# EAGLE design relaisarray (EAGLE 7.2.0)

## Sheet 1 of 5
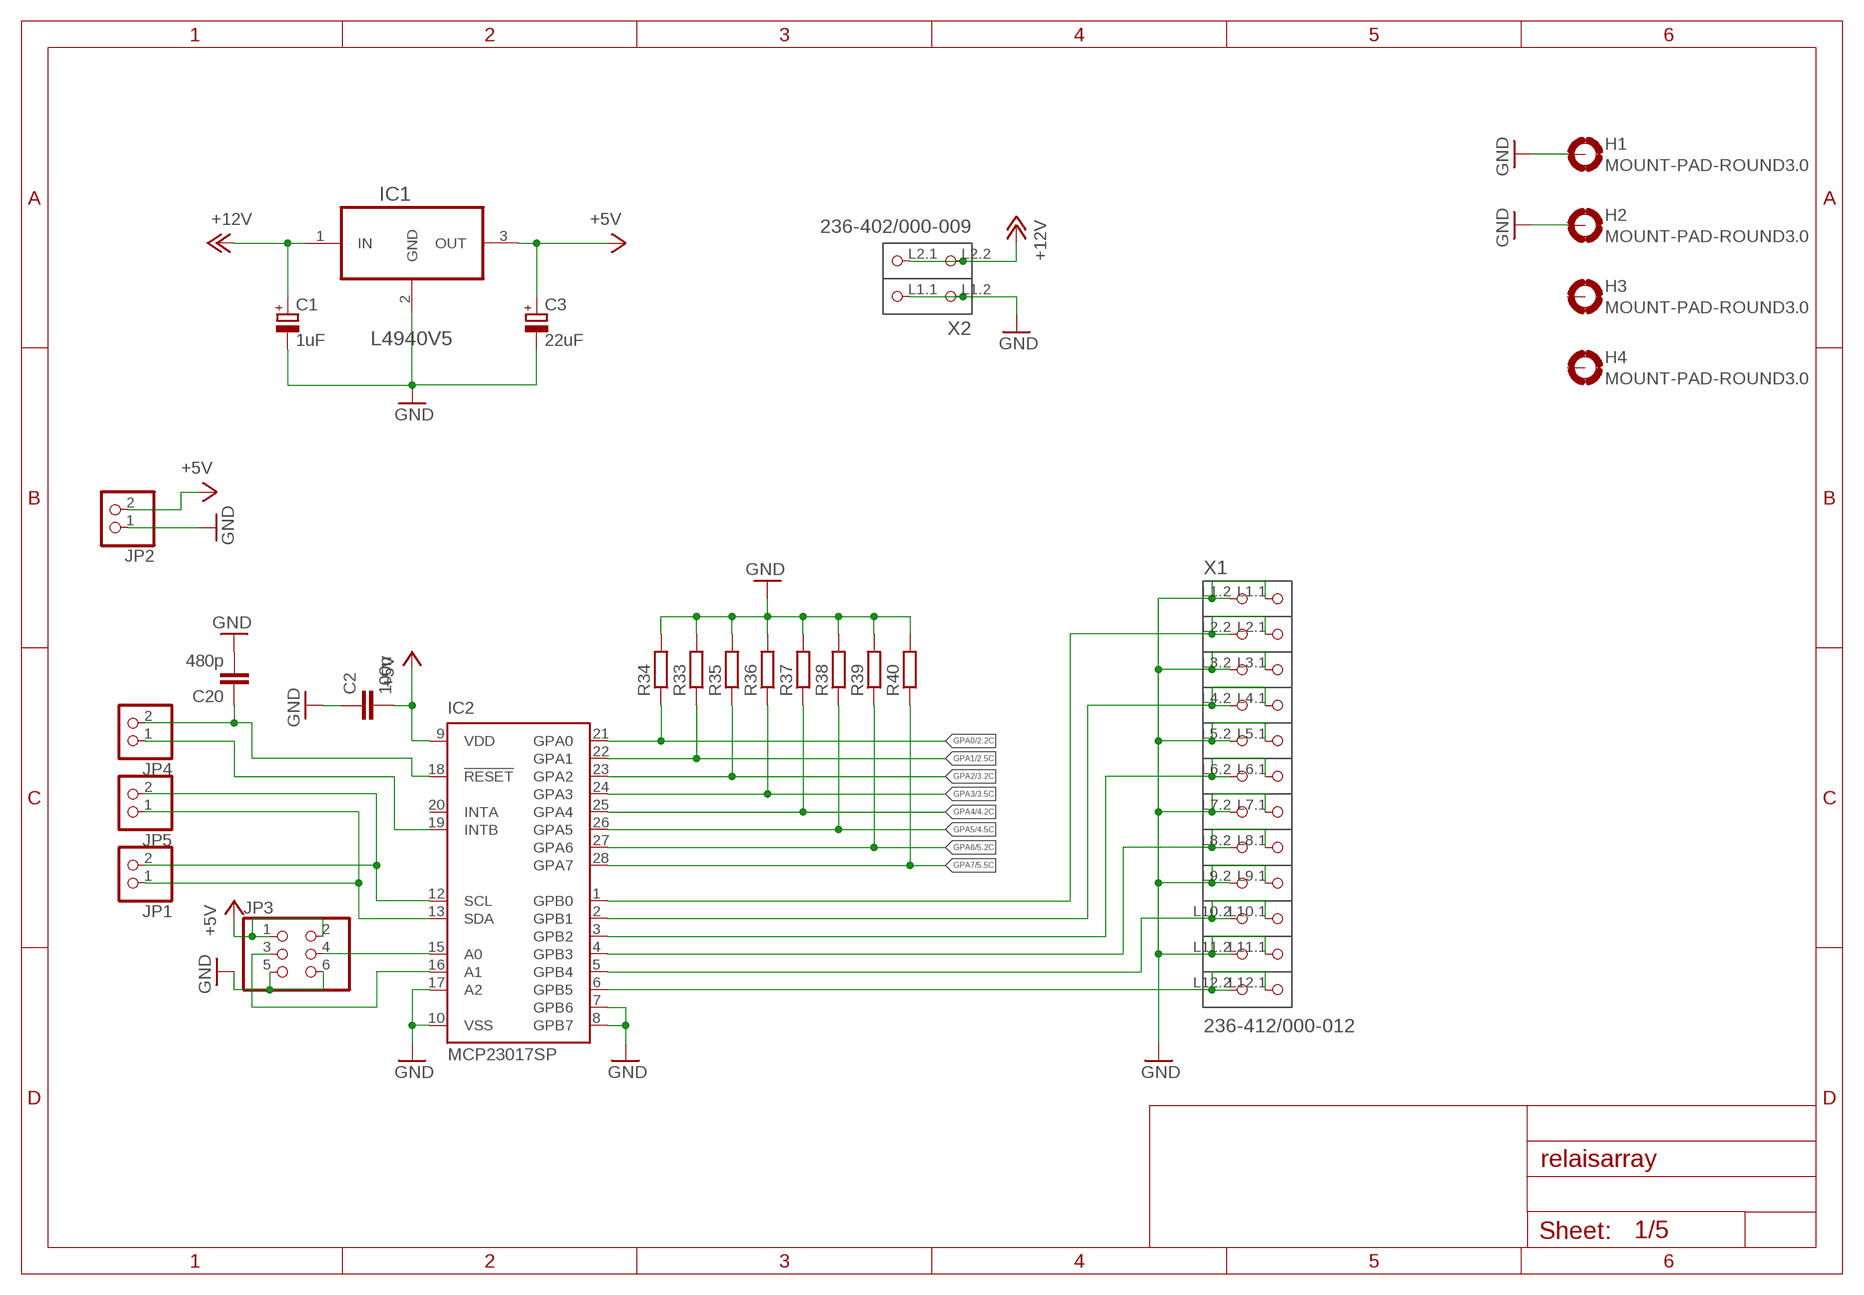
[diagram p0: schematic, sheet 1]

### Parts
C1  1uF  CPOL-EUTT2D5  [TT2D5]
C2  100n  C-EU050-035X075  [C050-035X075]
C3  22uF  CPOL-EUTT2D5  [TT2D5]
C20  480p  C-EU050-035X075  [C050-035X075]
H1  MOUNT-PAD-ROUND3.0  [3,0-PAD]
H2  MOUNT-PAD-ROUND3.0  [3,0-PAD]
H3  MOUNT-PAD-ROUND3.0  [3,0-PAD]
H4  MOUNT-PAD-ROUND3.0  [3,0-PAD]
IC1  L4940V5  [TO254P482X1024X3124-3P]
IC2  MCP23017SP  [DIL28-3]
JP1  PINHD-1X2  [1X02]
JP2  PINHD-1X2  [1X02]
JP3  PINHD-2X3  [2X03]
JP4  PINHD-1X2  [1X02]
JP5  PINHD-1X2  [1X02]
R33  R-EU_0207/10  [0207/10]
R34  R-EU_0207/10  [0207/10]
R35  R-EU_0207/10  [0207/10]
R36  R-EU_0207/10  [0207/10]
R37  R-EU_0207/10  [0207/10]
R38  R-EU_0207/10  [0207/10]
R39  R-EU_0207/10  [0207/10]
R40  R-EU_0207/10  [0207/10]
X1  236-412/000-012  [P-236-412]
X2  236-402/000-009  [P-236-402]

### Nets
+5V: C2.2 C3.+ IC1.3(OUT) IC2.9(VDD) JP2.2 JP3.1 JP3.2 ; also sheet 2,3,4,5
+12V: C1.+ IC1.1(IN) X2.L2.1(P2.1) X2.L2.2(P2.2) ; also sheet 2,3,4,5
GND: C1.- C2.1 C3.- C20.2 H1.B3,0(MOUNT) H2.B3,0(MOUNT) IC1.2(GND) IC2.7(GPB6) IC2.8(GPB7) IC2.10(VSS) IC2.17(A2) JP2.1 JP3.5 JP3.6 R33.2 R34.2 R35.2 R36.2 R37.2 R38.2 R39.2 R40.2 X1.L1.1(P1.1) X1.L1.2(P1.2) X1.L3.1(P3.1) X1.L3.2(P3.2) X1.L5.1(P5.1) X1.L5.2(P5.2) X1.L7.1(P7.1) X1.L7.2(P7.2) X1.L9.1(P9.1) X1.L9.2(P9.2) X1.L11.1(P11.1) X1.L11.2(P11.2) X2.L1.1(P1.1) X2.L1.2(P1.2) ; also sheet 2,3,4,5
GPA0: IC2.21(GPA0) R34.1 ; also sheet 2
GPA1: IC2.22(GPA1) R33.1 ; also sheet 2
GPA2: IC2.23(GPA2) R35.1 ; also sheet 3
GPA3: IC2.24(GPA3) R36.1 ; also sheet 3
GPA4: IC2.25(GPA4) R37.1 ; also sheet 4
GPA5: IC2.26(GPA5) R38.1 ; also sheet 4
GPA6: IC2.27(GPA6) R39.1 ; also sheet 5
GPA7: IC2.28(GPA7) R40.1 ; also sheet 5
INTB: IC2.19(INTB) JP4.1
N$8: IC2.16(A1) JP3.3
N$12: IC2.15(A0) JP3.4
N$14: IC2.6(GPB5) X1.L12.1(P12.1) X1.L12.2(P12.2)
N$15: IC2.5(GPB4) X1.L10.1(P10.1) X1.L10.2(P10.2)
N$16: IC2.4(GPB3) X1.L8.1(P8.1) X1.L8.2(P8.2)
N$17: IC2.3(GPB2) X1.L6.1(P6.1) X1.L6.2(P6.2)
N$18: IC2.2(GPB1) X1.L4.1(P4.1) X1.L4.2(P4.2)
N$19: IC2.1(GPB0) X1.L2.1(P2.1) X1.L2.2(P2.2)
RESET: C20.1 IC2.18(!RESET) JP4.2
SCL: IC2.12(SCL) JP1.2 JP5.2
SDA: IC2.13(SDA) JP1.1 JP5.1
Unconnected: H3.B3,0(MOUNT) H4.B3,0(MOUNT) IC2.20(INTA)

## Sheet 2 of 5
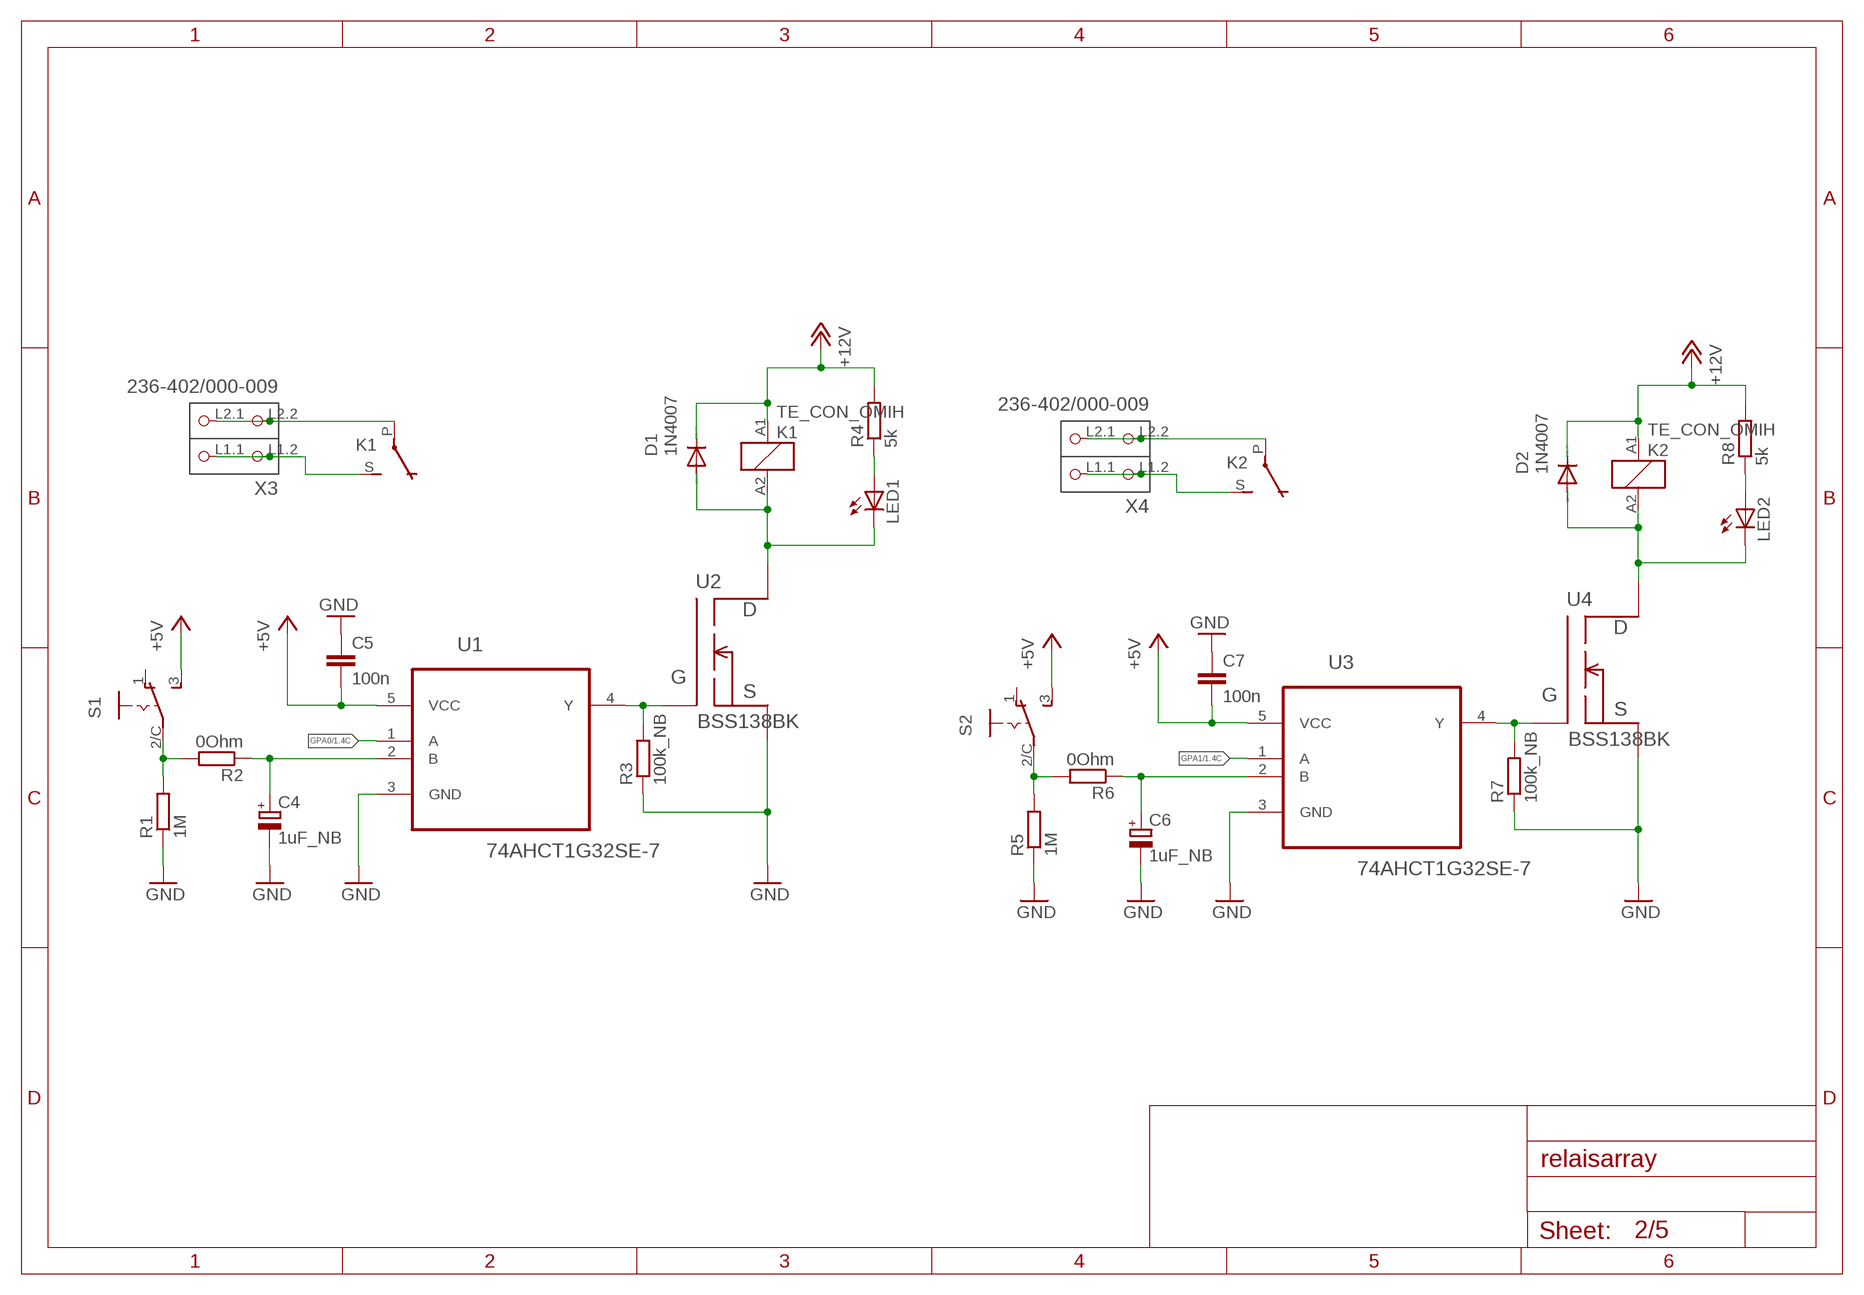
[diagram p1: schematic, sheet 2]

### Parts
C4  1uF_NB  CPOL-EUTT2D5  [TT2D5]
C5  100n  C-EU050-035X075  [C050-035X075]
C6  1uF_NB  CPOL-EUTT2D5  [TT2D5]
C7  100n  C-EU050-035X075  [C050-035X075]
D1  1N4007  1N4004  [DO41-10]
D2  1N4007  1N4004  [DO41-10]
K1  TE_CON_OMIH  [TE_CON_OMIH]
K2  TE_CON_OMIH  [TE_CON_OMIH]
LED1  LED5MM  [LED5MM]
LED2  LED5MM  [LED5MM]
R1  1M  R-EU_0207/10  [0207/10]
R2  0Ohm  R-EU_0207/10  [0207/10]
R3  100k_NB  R-EU_0207/10  [0207/10]
R4  5k  R-EU_0207/10  [0207/10]
R5  1M  R-EU_0207/10  [0207/10]
R6  0Ohm  R-EU_0207/10  [0207/10]
R7  100k_NB  R-EU_0207/10  [0207/10]
R8  5k  R-EU_0207/10  [0207/10]
S1  OS102011MS2QS1  [OS102011MS2QS1]
S2  OS102011MS2QS1  [OS102011MS2QS1]
U1  74AHCT1G32SE-7  [SOT65P210X110-5N]
U2  BSS138BK  [SOT65P210X110-3N]
U3  74AHCT1G32SE-7  [SOT65P210X110-5N]
U4  BSS138BK  [SOT65P210X110-3N]
X3  236-402/000-009  [P-236-402]
X4  236-402/000-009  [P-236-402]

### Nets
+5V: C5.2 C7.2 S1.3 S2.3 U1.5(VCC) U3.5(VCC) ; also sheet 1,3,4,5
+12V: D1.C D2.C K1.A1(1:A1) K2.A1(1:A1) R4.2 R8.2 ; also sheet 1,3,4,5
GND: C4.- C5.1 C6.- C7.1 R1.1 R3.1 R5.1 R7.1 U1.3(GND) U2.2(S) U3.3(GND) U4.2(S) ; also sheet 1,3,4,5
GPA0: U1.1(A) ; also sheet 1
GPA1: U3.1(A) ; also sheet 1
N$55: R3.2 U1.4(Y) U2.1(G)
N$56: LED1.A R4.1
N$57: D1.A K1.A2(1:A2) LED1.K(C) U2.3(D)
N$58: R1.2 R2.2 S1.2/C
N$59: K1.P(2:P) X3.L2.1(P2.1) X3.L2.2(P2.2)
N$60: K1.S(2:S) X3.L1.1(P1.1) X3.L1.2(P1.2)
N$61: C4.+ R2.1 U1.2(B)
N$62: R7.2 U3.4(Y) U4.1(G)
N$63: LED2.A R8.1
N$64: D2.A K2.A2(1:A2) LED2.K(C) U4.3(D)
N$65: R5.2 R6.2 S2.2/C
N$66: K2.P(2:P) X4.L2.1(P2.1) X4.L2.2(P2.2)
N$67: K2.S(2:S) X4.L1.1(P1.1) X4.L1.2(P1.2)
N$68: C6.+ R6.1 U3.2(B)
Unconnected: S1.1 S2.1

## Sheet 3 of 5
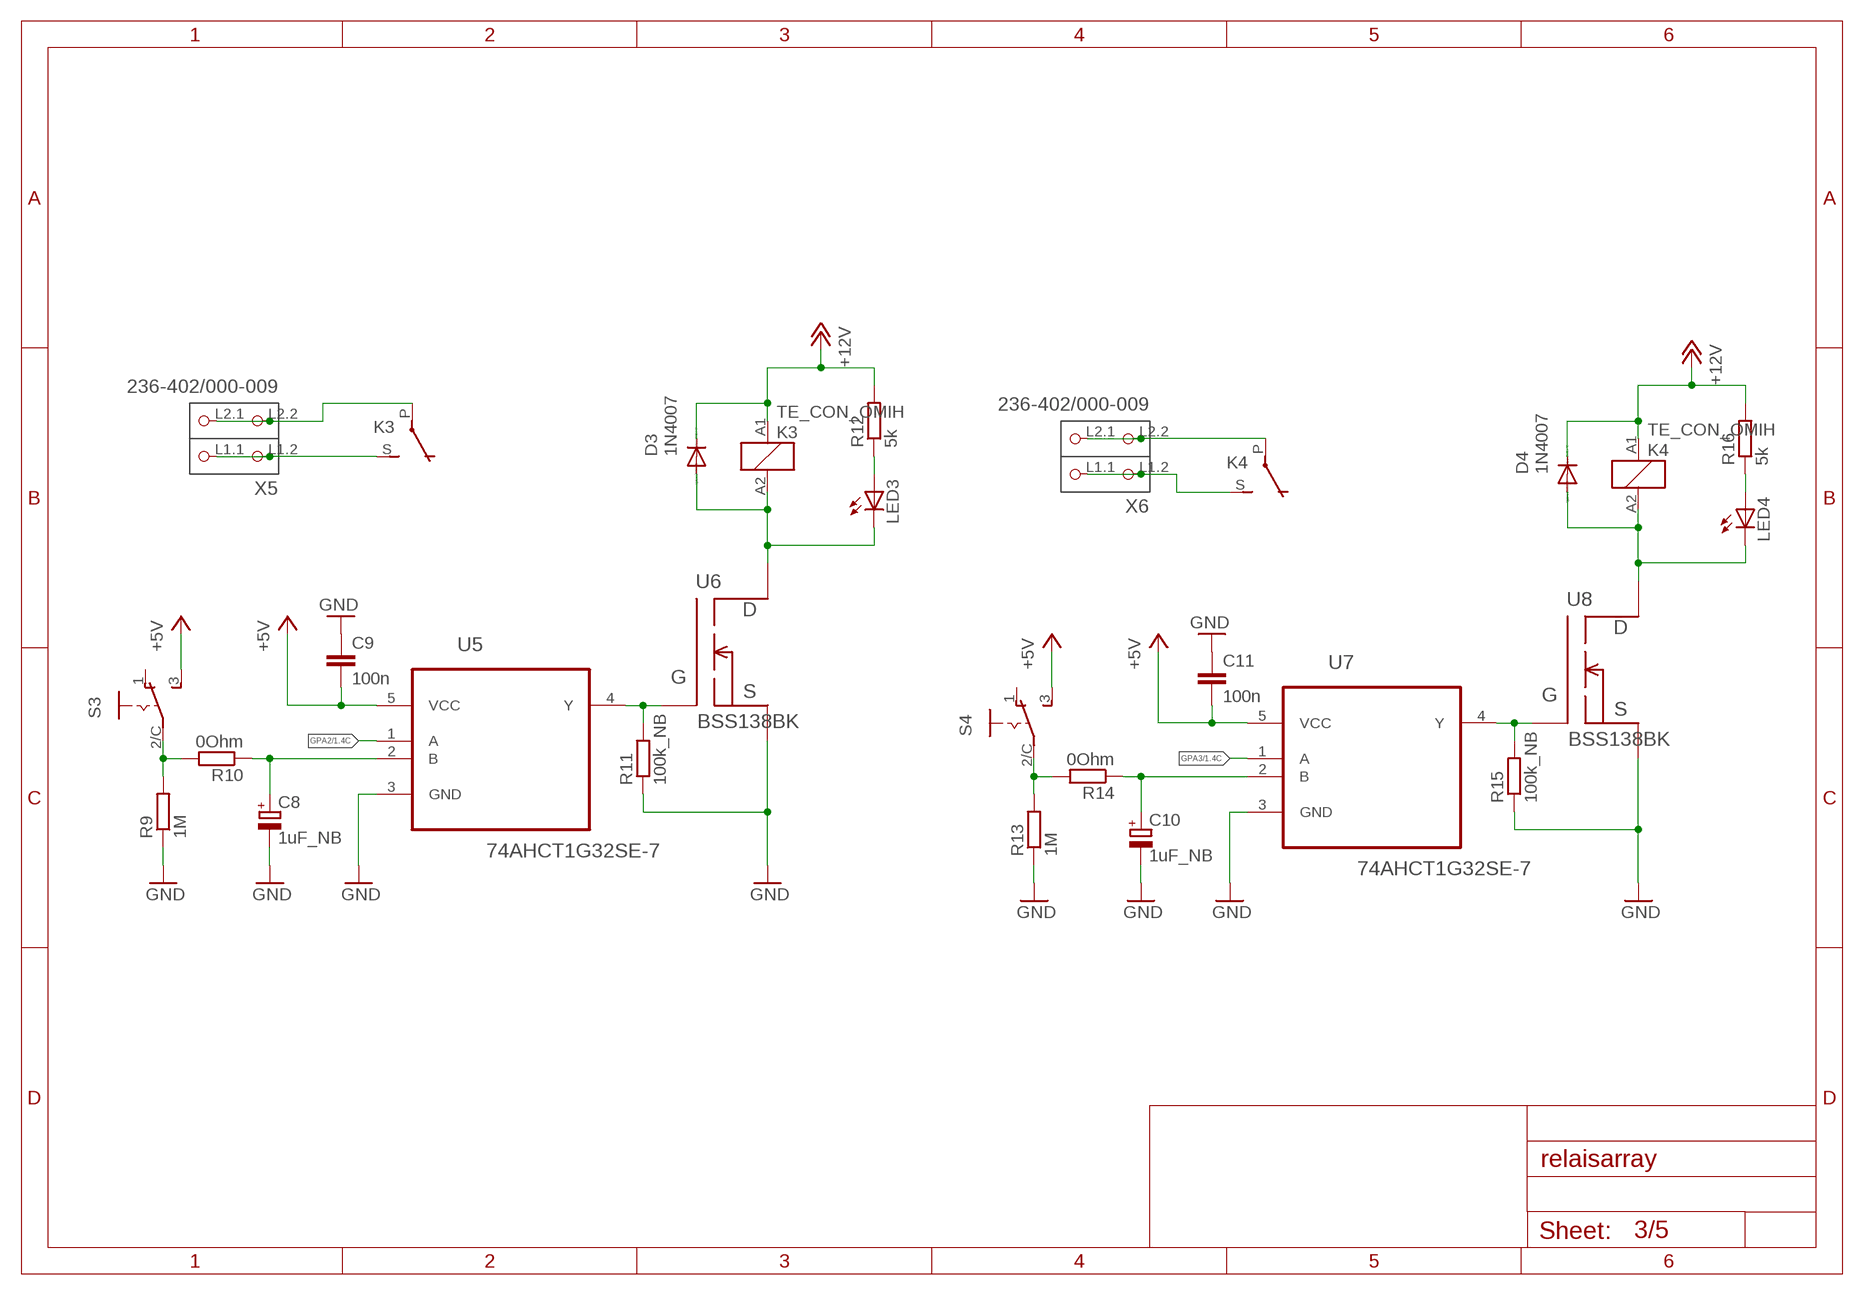
[diagram p2: schematic, sheet 3]

### Parts
C8  1uF_NB  CPOL-EUTT2D5  [TT2D5]
C9  100n  C-EU050-035X075  [C050-035X075]
C10  1uF_NB  CPOL-EUTT2D5  [TT2D5]
C11  100n  C-EU050-035X075  [C050-035X075]
D3  1N4007  1N4004  [DO41-10]
D4  1N4007  1N4004  [DO41-10]
K3  TE_CON_OMIH  [TE_CON_OMIH]
K4  TE_CON_OMIH  [TE_CON_OMIH]
LED3  LED5MM  [LED5MM]
LED4  LED5MM  [LED5MM]
R9  1M  R-EU_0207/10  [0207/10]
R10  0Ohm  R-EU_0207/10  [0207/10]
R11  100k_NB  R-EU_0207/10  [0207/10]
R12  5k  R-EU_0207/10  [0207/10]
R13  1M  R-EU_0207/10  [0207/10]
R14  0Ohm  R-EU_0207/10  [0207/10]
R15  100k_NB  R-EU_0207/10  [0207/10]
R16  5k  R-EU_0207/10  [0207/10]
S3  OS102011MS2QS1  [OS102011MS2QS1]
S4  OS102011MS2QS1  [OS102011MS2QS1]
U5  74AHCT1G32SE-7  [SOT65P210X110-5N]
U6  BSS138BK  [SOT65P210X110-3N]
U7  74AHCT1G32SE-7  [SOT65P210X110-5N]
U8  BSS138BK  [SOT65P210X110-3N]
X5  236-402/000-009  [P-236-402]
X6  236-402/000-009  [P-236-402]

### Nets
+5V: C9.2 C11.2 S3.3 S4.3 U5.5(VCC) U7.5(VCC) ; also sheet 1,2,4,5
+12V: D3.C D4.C K3.A1(1:A1) K4.A1(1:A1) R12.2 R16.2 ; also sheet 1,2,4,5
GND: C8.- C9.1 C10.- C11.1 R9.1 R11.1 R13.1 R15.1 U5.3(GND) U6.2(S) U7.3(GND) U8.2(S) ; also sheet 1,2,4,5
GPA2: U5.1(A) ; also sheet 1
GPA3: U7.1(A) ; also sheet 1
N$1: R11.2 U5.4(Y) U6.1(G)
N$2: LED3.A R12.1
N$3: D3.A K3.A2(1:A2) LED3.K(C) U6.3(D)
N$4: R9.2 R10.2 S3.2/C
N$5: K3.P(2:P) X5.L2.1(P2.1) X5.L2.2(P2.2)
N$6: K3.S(2:S) X5.L1.1(P1.1) X5.L1.2(P1.2)
N$7: C8.+ R10.1 U5.2(B)
N$20: R15.2 U7.4(Y) U8.1(G)
N$21: LED4.A R16.1
N$22: D4.A K4.A2(1:A2) LED4.K(C) U8.3(D)
N$23: R13.2 R14.2 S4.2/C
N$24: K4.P(2:P) X6.L2.1(P2.1) X6.L2.2(P2.2)
N$25: K4.S(2:S) X6.L1.1(P1.1) X6.L1.2(P1.2)
N$26: C10.+ R14.1 U7.2(B)
Unconnected: S3.1 S4.1

## Sheet 4 of 5
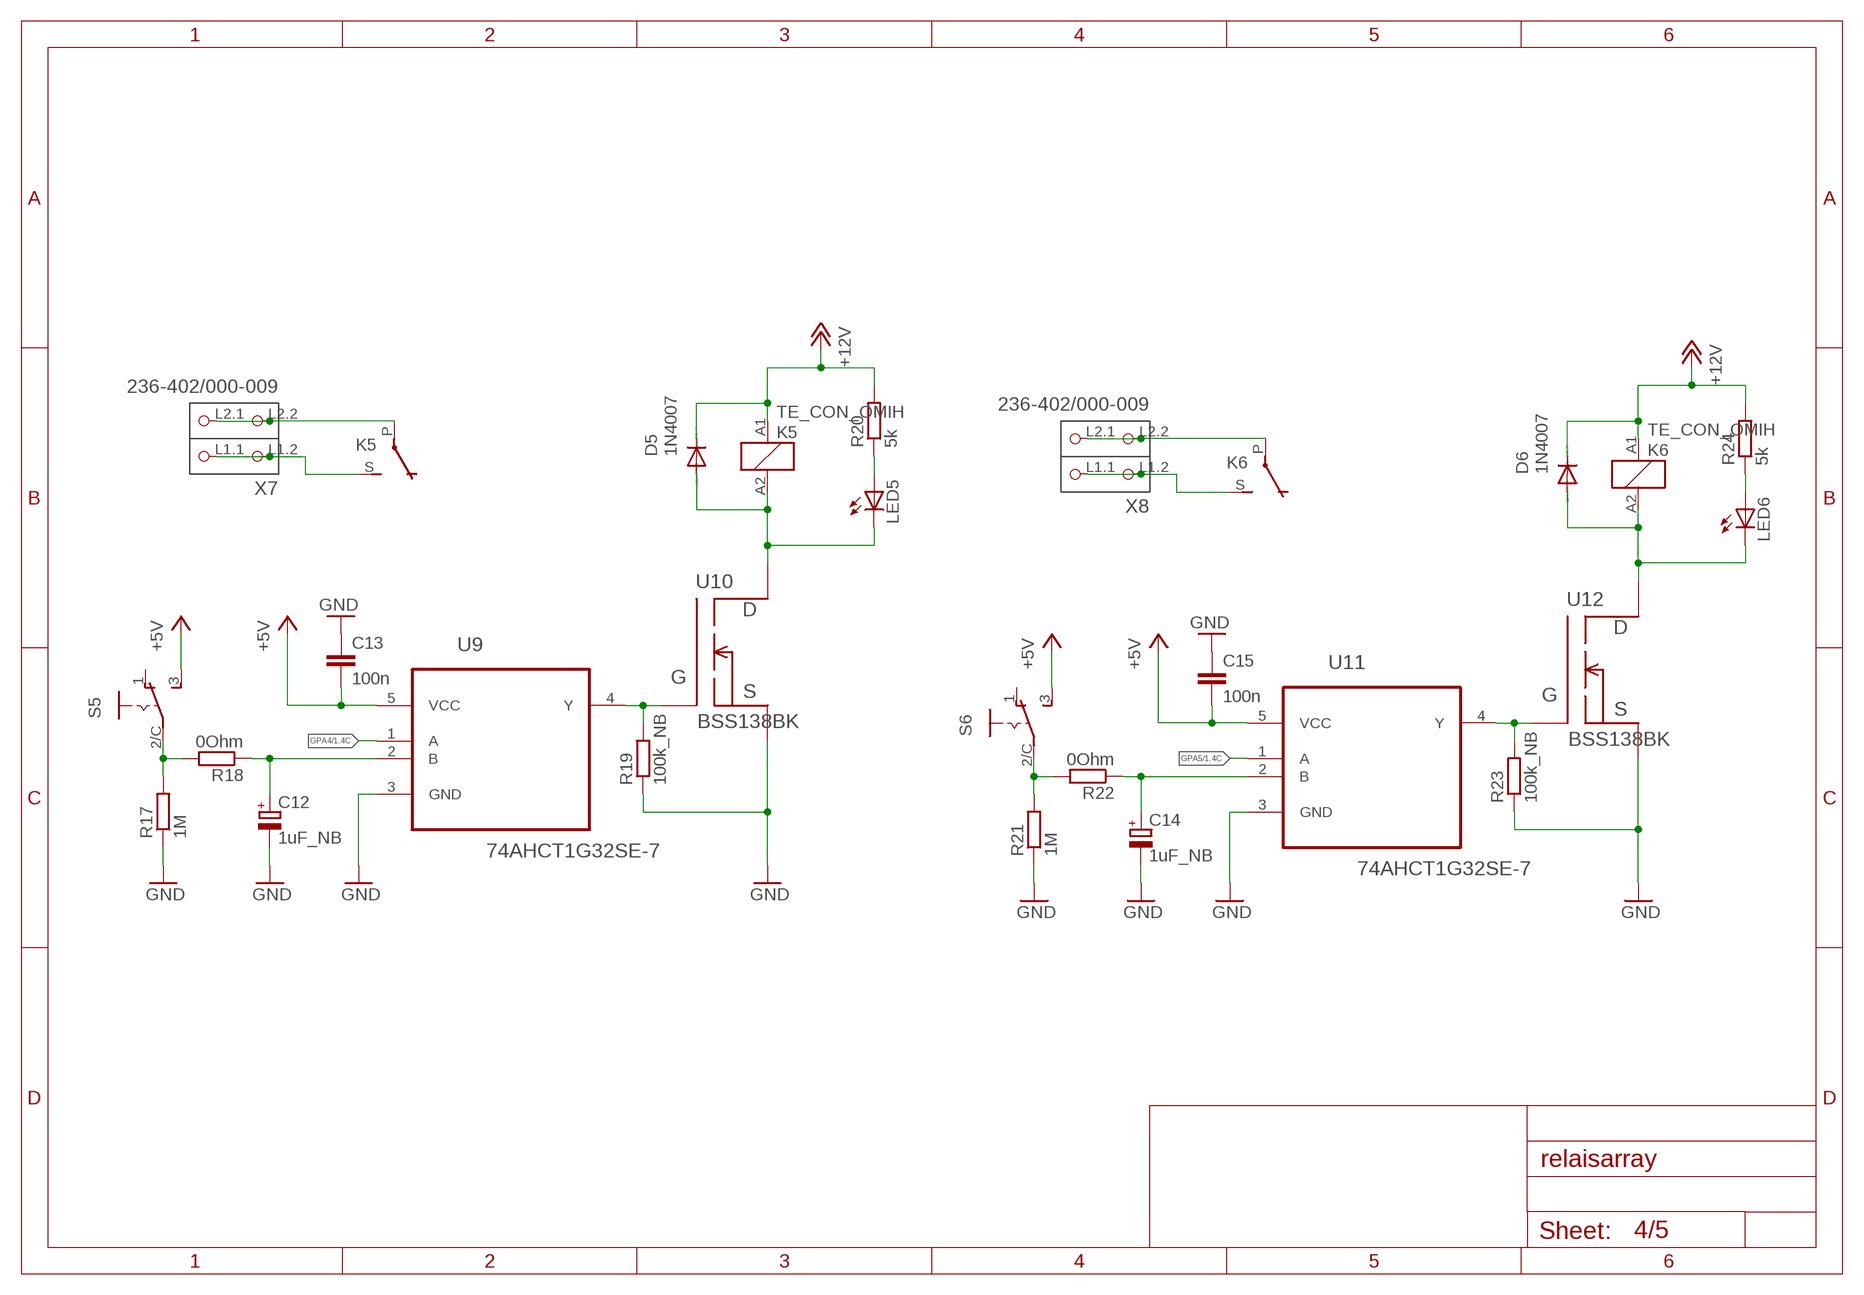
[diagram p3: schematic, sheet 4]

### Parts
C12  1uF_NB  CPOL-EUTT2D5  [TT2D5]
C13  100n  C-EU050-035X075  [C050-035X075]
C14  1uF_NB  CPOL-EUTT2D5  [TT2D5]
C15  100n  C-EU050-035X075  [C050-035X075]
D5  1N4007  1N4004  [DO41-10]
D6  1N4007  1N4004  [DO41-10]
K5  TE_CON_OMIH  [TE_CON_OMIH]
K6  TE_CON_OMIH  [TE_CON_OMIH]
LED5  LED5MM  [LED5MM]
LED6  LED5MM  [LED5MM]
R17  1M  R-EU_0207/10  [0207/10]
R18  0Ohm  R-EU_0207/10  [0207/10]
R19  100k_NB  R-EU_0207/10  [0207/10]
R20  5k  R-EU_0207/10  [0207/10]
R21  1M  R-EU_0207/10  [0207/10]
R22  0Ohm  R-EU_0207/10  [0207/10]
R23  100k_NB  R-EU_0207/10  [0207/10]
R24  5k  R-EU_0207/10  [0207/10]
S5  OS102011MS2QS1  [OS102011MS2QS1]
S6  OS102011MS2QS1  [OS102011MS2QS1]
U9  74AHCT1G32SE-7  [SOT65P210X110-5N]
U10  BSS138BK  [SOT65P210X110-3N]
U11  74AHCT1G32SE-7  [SOT65P210X110-5N]
U12  BSS138BK  [SOT65P210X110-3N]
X7  236-402/000-009  [P-236-402]
X8  236-402/000-009  [P-236-402]

### Nets
+5V: C13.2 C15.2 S5.3 S6.3 U9.5(VCC) U11.5(VCC) ; also sheet 1,2,3,5
+12V: D5.C D6.C K5.A1(1:A1) K6.A1(1:A1) R20.2 R24.2 ; also sheet 1,2,3,5
GND: C12.- C13.1 C14.- C15.1 R17.1 R19.1 R21.1 R23.1 U9.3(GND) U10.2(S) U11.3(GND) U12.2(S) ; also sheet 1,2,3,5
GPA4: U9.1(A) ; also sheet 1
GPA5: U11.1(A) ; also sheet 1
N$27: R19.2 U9.4(Y) U10.1(G)
N$28: LED5.A R20.1
N$29: D5.A K5.A2(1:A2) LED5.K(C) U10.3(D)
N$30: R17.2 R18.2 S5.2/C
N$31: K5.P(2:P) X7.L2.1(P2.1) X7.L2.2(P2.2)
N$32: K5.S(2:S) X7.L1.1(P1.1) X7.L1.2(P1.2)
N$33: C12.+ R18.1 U9.2(B)
N$34: R23.2 U11.4(Y) U12.1(G)
N$35: LED6.A R24.1
N$36: D6.A K6.A2(1:A2) LED6.K(C) U12.3(D)
N$37: R21.2 R22.2 S6.2/C
N$38: K6.P(2:P) X8.L2.1(P2.1) X8.L2.2(P2.2)
N$39: K6.S(2:S) X8.L1.1(P1.1) X8.L1.2(P1.2)
N$40: C14.+ R22.1 U11.2(B)
Unconnected: S5.1 S6.1

## Sheet 5 of 5
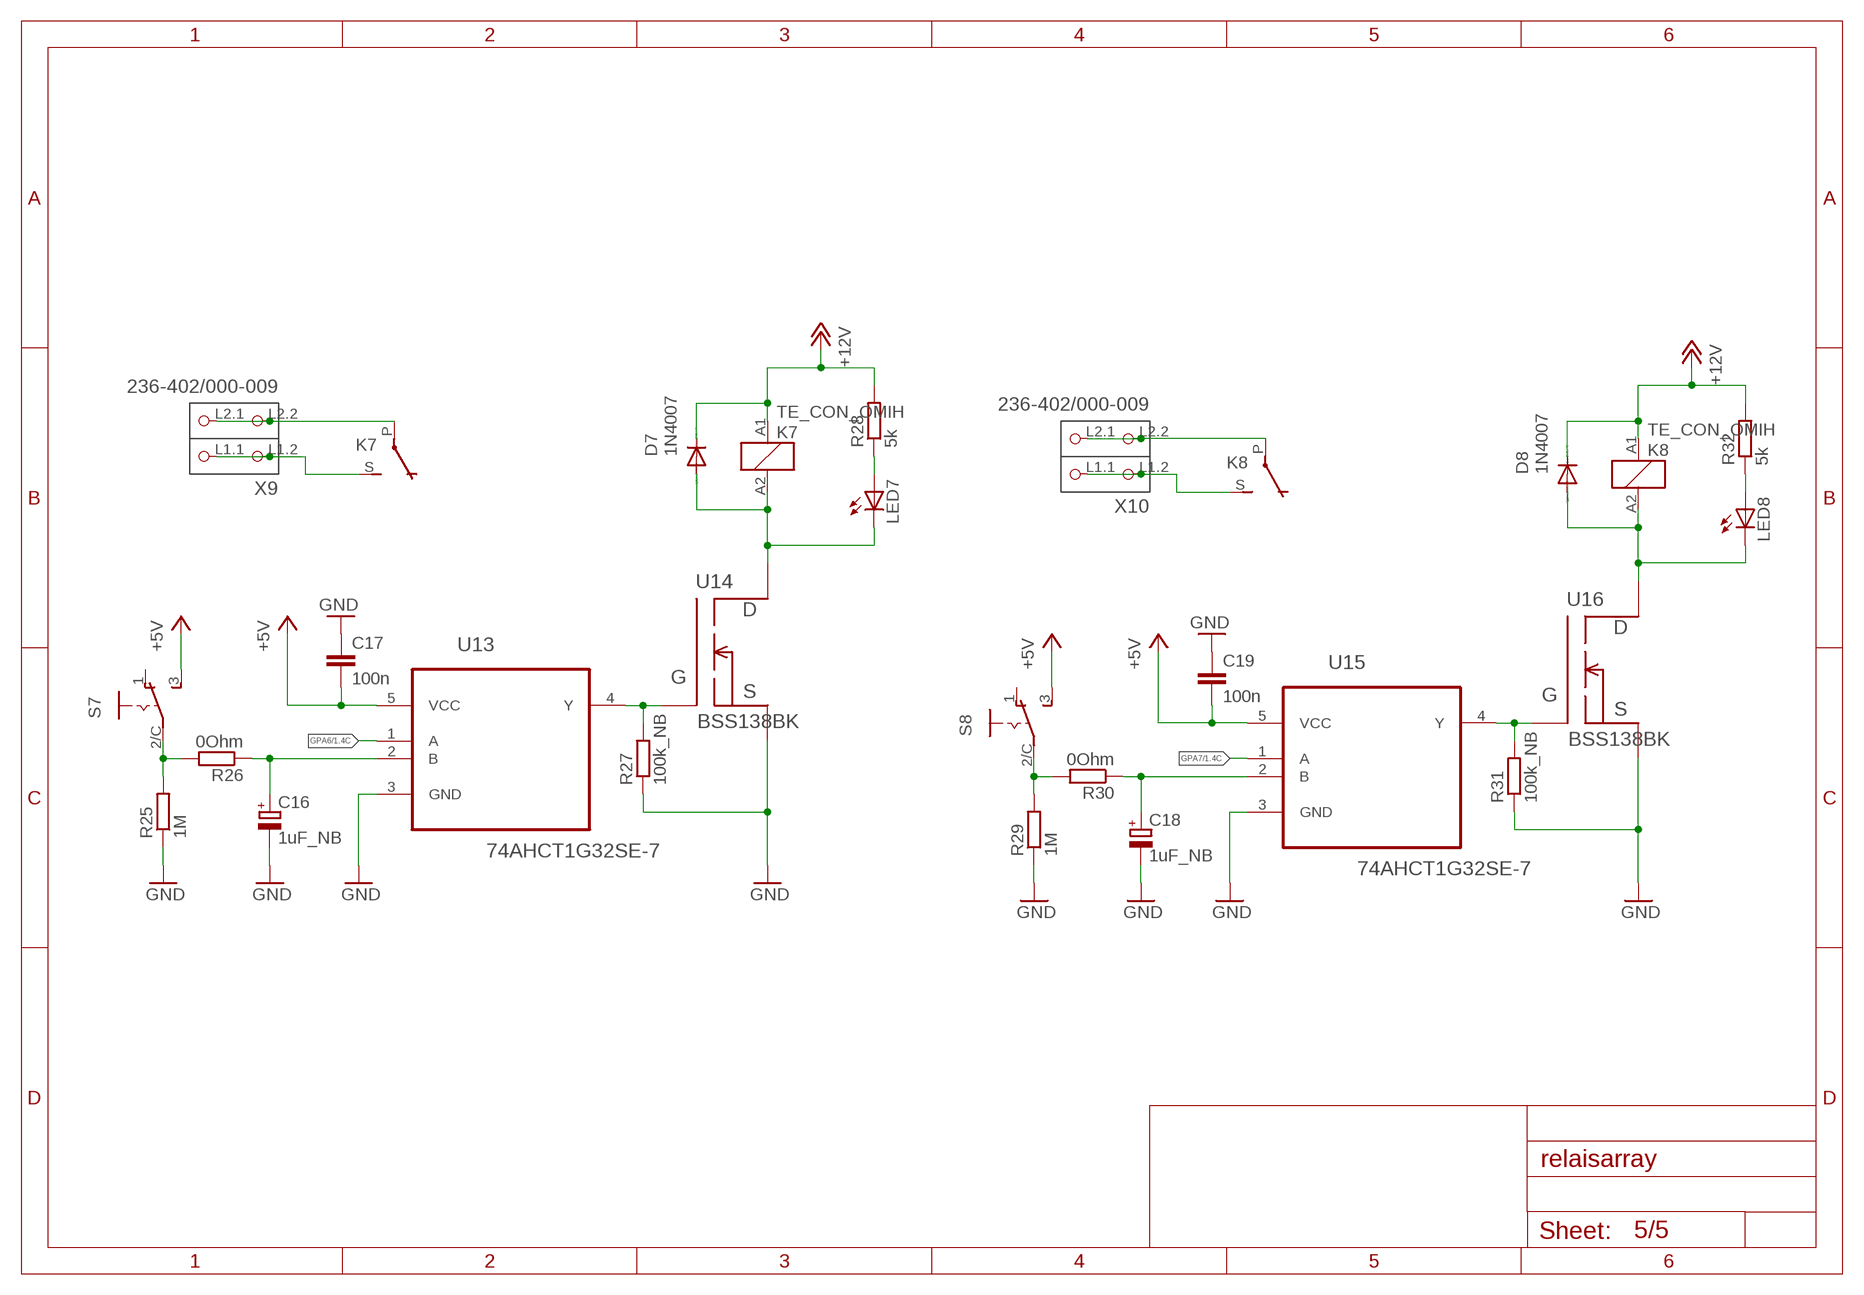
[diagram p4: schematic, sheet 5]

### Parts
C16  1uF_NB  CPOL-EUTT2D5  [TT2D5]
C17  100n  C-EU050-035X075  [C050-035X075]
C18  1uF_NB  CPOL-EUTT2D5  [TT2D5]
C19  100n  C-EU050-035X075  [C050-035X075]
D7  1N4007  1N4004  [DO41-10]
D8  1N4007  1N4004  [DO41-10]
K7  TE_CON_OMIH  [TE_CON_OMIH]
K8  TE_CON_OMIH  [TE_CON_OMIH]
LED7  LED5MM  [LED5MM]
LED8  LED5MM  [LED5MM]
R25  1M  R-EU_0207/10  [0207/10]
R26  0Ohm  R-EU_0207/10  [0207/10]
R27  100k_NB  R-EU_0207/10  [0207/10]
R28  5k  R-EU_0207/10  [0207/10]
R29  1M  R-EU_0207/10  [0207/10]
R30  0Ohm  R-EU_0207/10  [0207/10]
R31  100k_NB  R-EU_0207/10  [0207/10]
R32  5k  R-EU_0207/10  [0207/10]
S7  OS102011MS2QS1  [OS102011MS2QS1]
S8  OS102011MS2QS1  [OS102011MS2QS1]
U13  74AHCT1G32SE-7  [SOT65P210X110-5N]
U14  BSS138BK  [SOT65P210X110-3N]
U15  74AHCT1G32SE-7  [SOT65P210X110-5N]
U16  BSS138BK  [SOT65P210X110-3N]
X9  236-402/000-009  [P-236-402]
X10  236-402/000-009  [P-236-402]

### Nets
+5V: C17.2 C19.2 S7.3 S8.3 U13.5(VCC) U15.5(VCC) ; also sheet 1,2,3,4
+12V: D7.C D8.C K7.A1(1:A1) K8.A1(1:A1) R28.2 R32.2 ; also sheet 1,2,3,4
GND: C16.- C17.1 C18.- C19.1 R25.1 R27.1 R29.1 R31.1 U13.3(GND) U14.2(S) U15.3(GND) U16.2(S) ; also sheet 1,2,3,4
GPA6: U13.1(A) ; also sheet 1
GPA7: U15.1(A) ; also sheet 1
N$41: R27.2 U13.4(Y) U14.1(G)
N$42: LED7.A R28.1
N$43: D7.A K7.A2(1:A2) LED7.K(C) U14.3(D)
N$44: R25.2 R26.2 S7.2/C
N$45: K7.P(2:P) X9.L2.1(P2.1) X9.L2.2(P2.2)
N$46: K7.S(2:S) X9.L1.1(P1.1) X9.L1.2(P1.2)
N$47: C16.+ R26.1 U13.2(B)
N$48: R31.2 U15.4(Y) U16.1(G)
N$49: LED8.A R32.1
N$50: D8.A K8.A2(1:A2) LED8.K(C) U16.3(D)
N$51: R29.2 R30.2 S8.2/C
N$52: K8.P(2:P) X10.L2.1(P2.1) X10.L2.2(P2.2)
N$53: K8.S(2:S) X10.L1.1(P1.1) X10.L1.2(P1.2)
N$54: C18.+ R30.1 U15.2(B)
Unconnected: S7.1 S8.1

## Library data of the parts
C1 C3 C4 C6 C8 C10 C12 C14 C16 C18 = rcl:CPOL-EU: POLARIZED CAPACITOR, European symbol
C2 C5 C7 C9 C11 C13 C15 C17 C19 C20 = rcl:C-EU: CAPACITOR, European symbol
D1-D8 = diode:1N4004: DIODE general purpose rectifier, 1 A
H1-H4 = holes:MOUNT-PAD-ROUND: MOUNTING PAD, round
IC1 = L4940V5:L4940V5: IC, V REG LDO +5.0V, 4940, TO-220-3; MPN: L4940V5; OC_FARNELL: 9756060; OC_NEWARK: 89K0746; PACKAGE: TO-220-3; SUPPLIER: STMicroelectronics
IC2 = microchip:MCP23017: http://ww1.microchip.com/downloads/en/DeviceDoc/21952a.pdf Source: http://ww1.microchip.com/downloads/en/DeviceDoc/21952a.pdf; MF: MICROCHIP; MPN: MCP23017-E/SP; OC_FARNELL: 1332088; OC_NEWARK: 31K2959
JP1 JP2 JP4 JP5 = pinhead:PINHD-1X2: PIN HEADER
JP3 = pinhead:PINHD-2X3: PIN HEADER
K1-K8 = TE_CON_OMIH:TE_CON_OMIH: Power PCB Relay OMIH TE Connectivity 250V/ 16 A - 12V Coil Farnell: 1891736
LED1-LED8 = led:LED: LED OSRAM: - CHIPLED LG R971, LG N971, LY N971, LG Q971, LY Q971, LO R971, LY R971 LH N974, LH R974 LS Q976, LO Q976, LY Q976 LO Q996 - Hyper CHIPLED LW Q18S LB Q993, LB Q99A, LB R99A - SideLED LS A670, LO A670, LY A670, LG A670, LP A670 LB A673, LV A673, LT A673, LW A673 LH A674 LY A675 LS A676, LA A676, LO A676, LY A676, LW A676 LS A679, LY A679, LG A679 - Hyper Micro SIDELED® LS Y876, LA Y876, LO Y876, LY Y876 LT Y87S - SmartLED LW L88C, LW L88S LB L89C, LB L89S, LG L890 LS L89K, LO L89K, LY L89K LS L896, LA L896, LO L896, LY L896 - TOPLED LS T670, LO T670, LY T670, LG T670, LP T670 LSG T670, LSP T670, LSY T670, LOP T670, LYG T670 LG T671, LOG T671, LSG T671 LB T673, LV T673, LT T673, LW T673 LH T674 LS T676, LA T676, LO T676, LY T676, LB T676, LH T676, LSB T676, LW T676 LB T67C, LV T67C, LT T67C, LS T67K, LO T67K, LY T67K, LW E67C LS E67B, LA E67B, LO E67B, LY E67B, LB E67C, LV E67C, LT E67C LW T67C LS T679, LY T679, LG T679 LS T770, LO T770, LY T770, LG T770, LP T770 LB T773, LV T773, LT T773, LW T773 LH T774 LS E675, LA E675, LY E675, LS T675 LS T776, LA T776, LO T776, LY T776, LB T776 LHGB T686 LT T68C, LB T68C - Hyper Mini TOPLED® LB M676 - Mini TOPLED Santana® LG M470 LS M47K, LO M47K, LY M47K Source: http://www.osram.convergy.de LUXEON: - LUMILED® LXK2-PW12-R00, LXK2-PW12-S00, LXK2-PW14-U00, LXK2-PW14-V00 LXK2-PM12-R00, LXK2-PM12-S00, LXK2-PM14-U00 LXK2-PE12-Q00, LXK2-PE12-R00, LXK2-PE12-S00, LXK2-PE14-T00, LXK2-PE14-U00 LXK2-PB12-K00, LXK2-PB12-L00, LXK2-PB12-M00, LXK2-PB14-N00, LXK2-PB14-P00, LXK2-PB14-Q00 LXK2-PR12-L00, LXK2-PR12-M00, LXK2-PR14-Q00, LXK2-PR14-R00 LXK2-PD12-Q00, LXK2-PD12-R00, LXK2-PD12-S00 LXK2-PH12-R00, LXK2-PH12-S00 LXK2-PL12-P00, LXK2-PL12-Q00, LXK2-PL12-R00 Source: www.luxeon.com KINGBRIGHT: KA-3528ASYC Source: www.kingbright.com
R1-R40 = rcl:R-EU_: RESISTOR, European symbol
S1-S8 = OS102011MS2QS1:OS102011MS2QS1: SLIDING SWITCH Distributor Farnell: 2435105
U1 U3 U5 U7 U9 U11 U13 U15 = 74AHCT1G32SE:74AHCT1G32SE-7: SINGLE 2 INPUT POSITIVE OR GATE; MPN: 74AHCT1G32SE-7; OC_FARNELL: 2057398; OC_NEWARK: 64T4877; PACKAGE: SOT-353-5; SUPPLIER: Diodes INC
U2 U4 U6 U8 U10 U12 U14 U16 = BSS138:BSS138BK: N-channel Trench MOSFET; MPN: BSS138BK; OC_FARNELL: 2053833; OC_NEWARK: 61T7486; PACKAGE: SOT-23-3; SUPPLIER: NXP
X1 = con-wago_236:236-412/000-012: Stand: 01.01.2014. Die jeweils aktuellen Daten zu diesem Artikel finden Sie in unserem Produktkatalog, den Sie unter www.wago.com einsehen können. As of: 01/01/2014. Please find the newest data for this article in our product catalogue, which can be viewed under www.wago.com.
X2-X10 = con-wago_236:236-402/000-009: Serie 236, / Series 236, Polzahl / Pole No.: 2 Rastermaß / Pitch: 5 - 5.08 mm Bemessungsspannung / Rated Voltage: 320 V Nennstrom / Nominal Current: 24 A Leiterquerschnitt / Conductor Size: 0.08 - 2.5 mm2 Anschlusstechnik / Connection Technology: CAGE CLAMP® Lötstiftlänge: / Solder Pin Length: 4 mm Leitereinführung (zur Platine) / Conductor entry angle (to PCB): 45 ° Farbe / Color: lichtgrau / lichtgrau Stand: 01.01.2014. Die jeweils aktuellen Daten zu diesem Artikel finden Sie in unserem Produktkatalog, den Sie unter www.wago.com einsehen können. As of: 01/01/2014. Please find the newest data for this article in our product catalogue, which can be viewed under www.wago.com.

## Net classes
0 default: clearance 0.205 mm

## Board
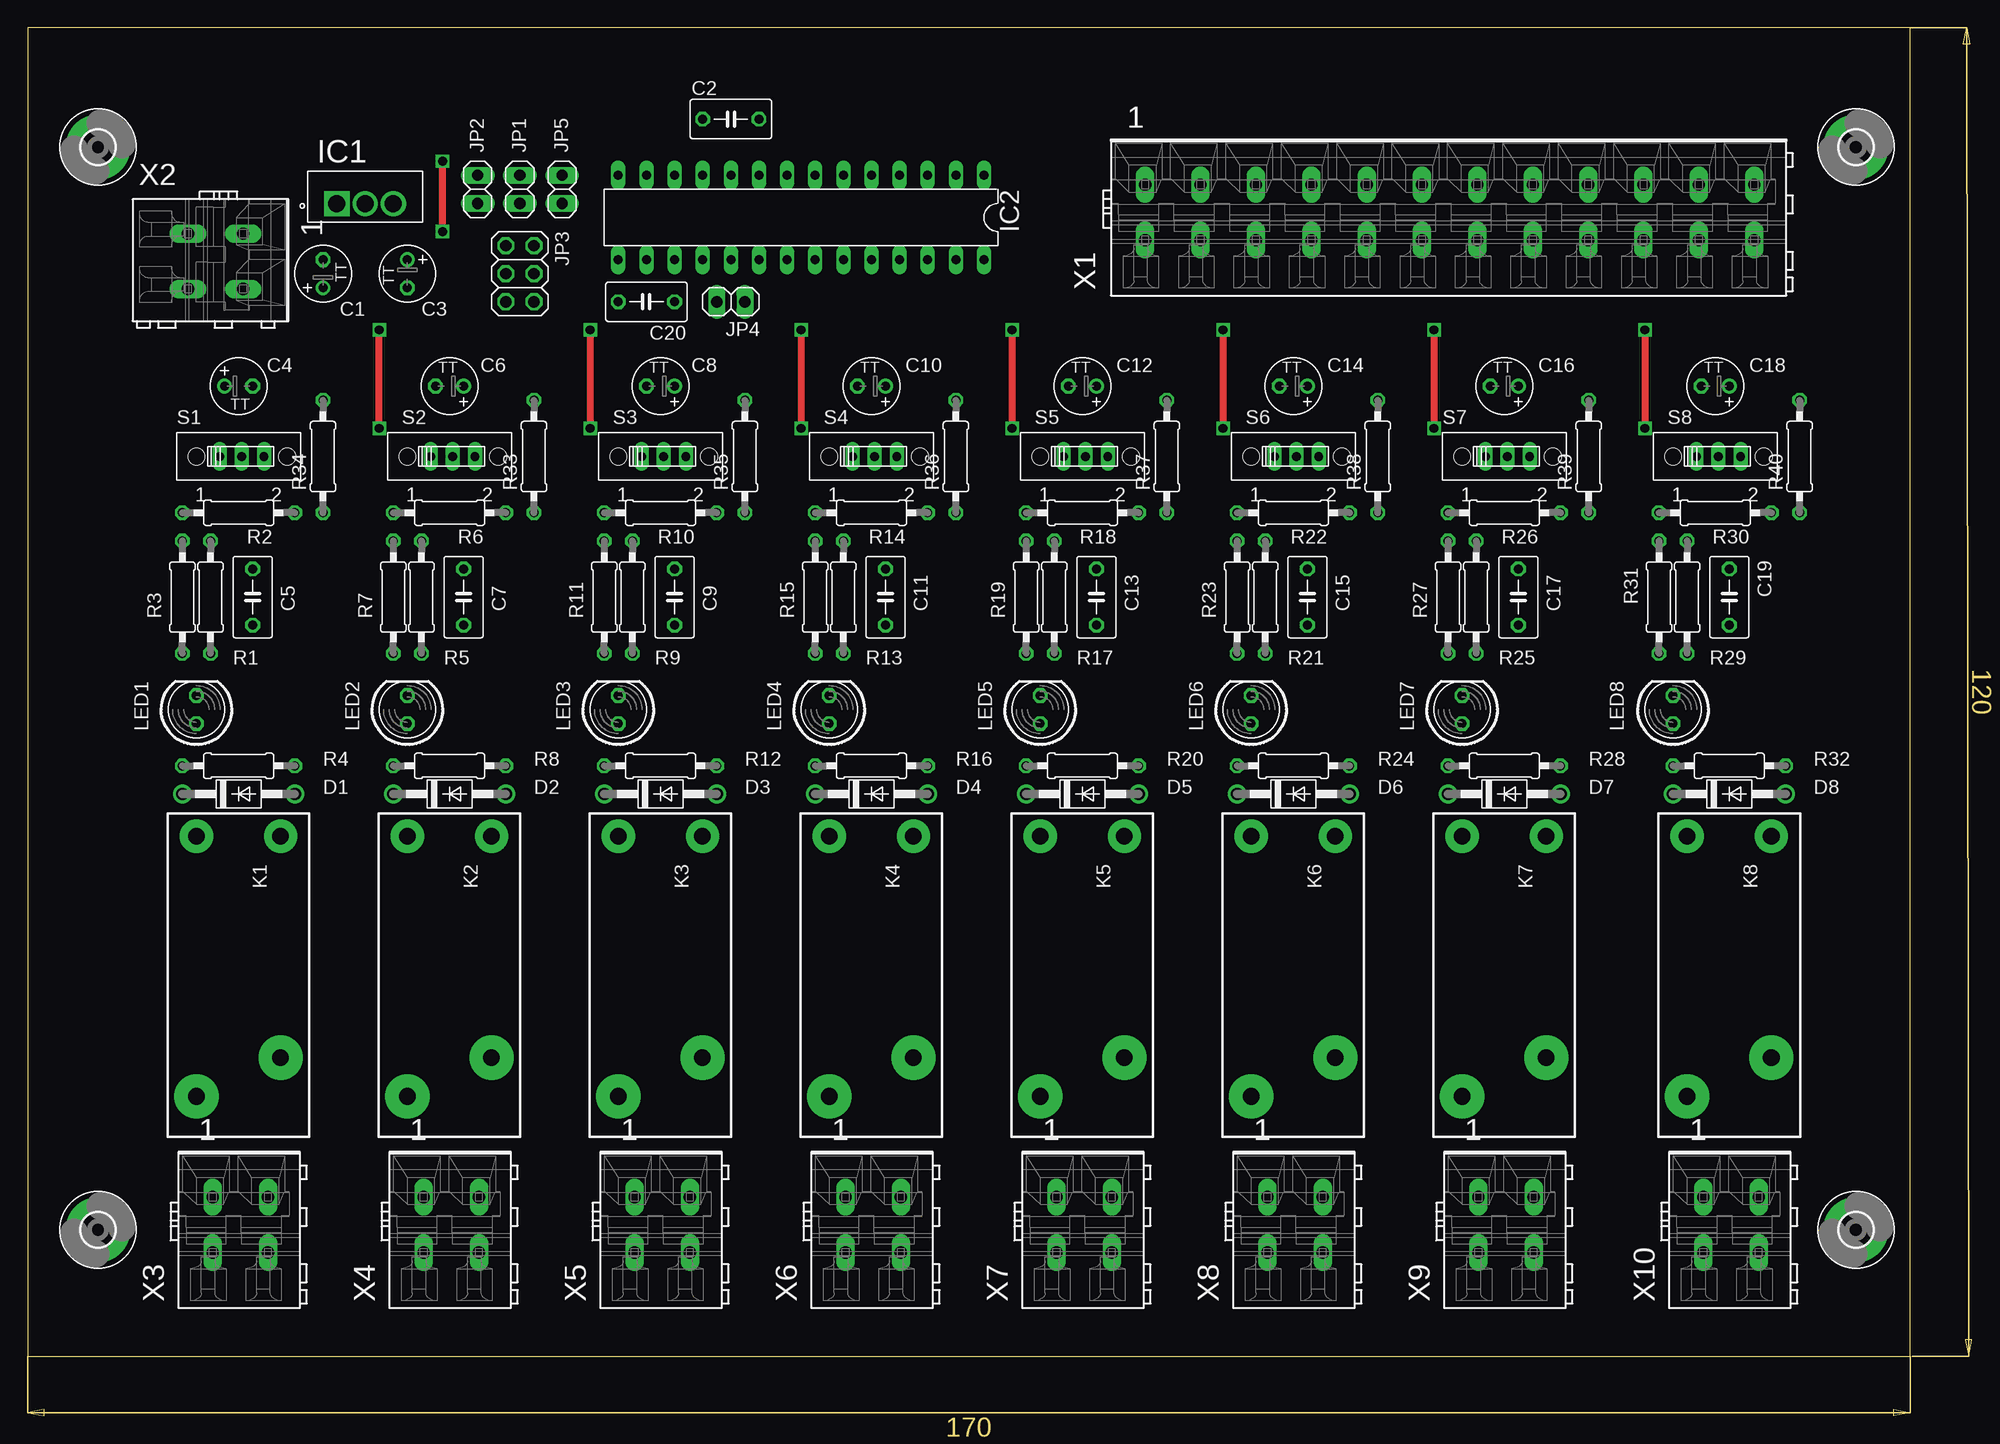
[diagram p5: board, top side]
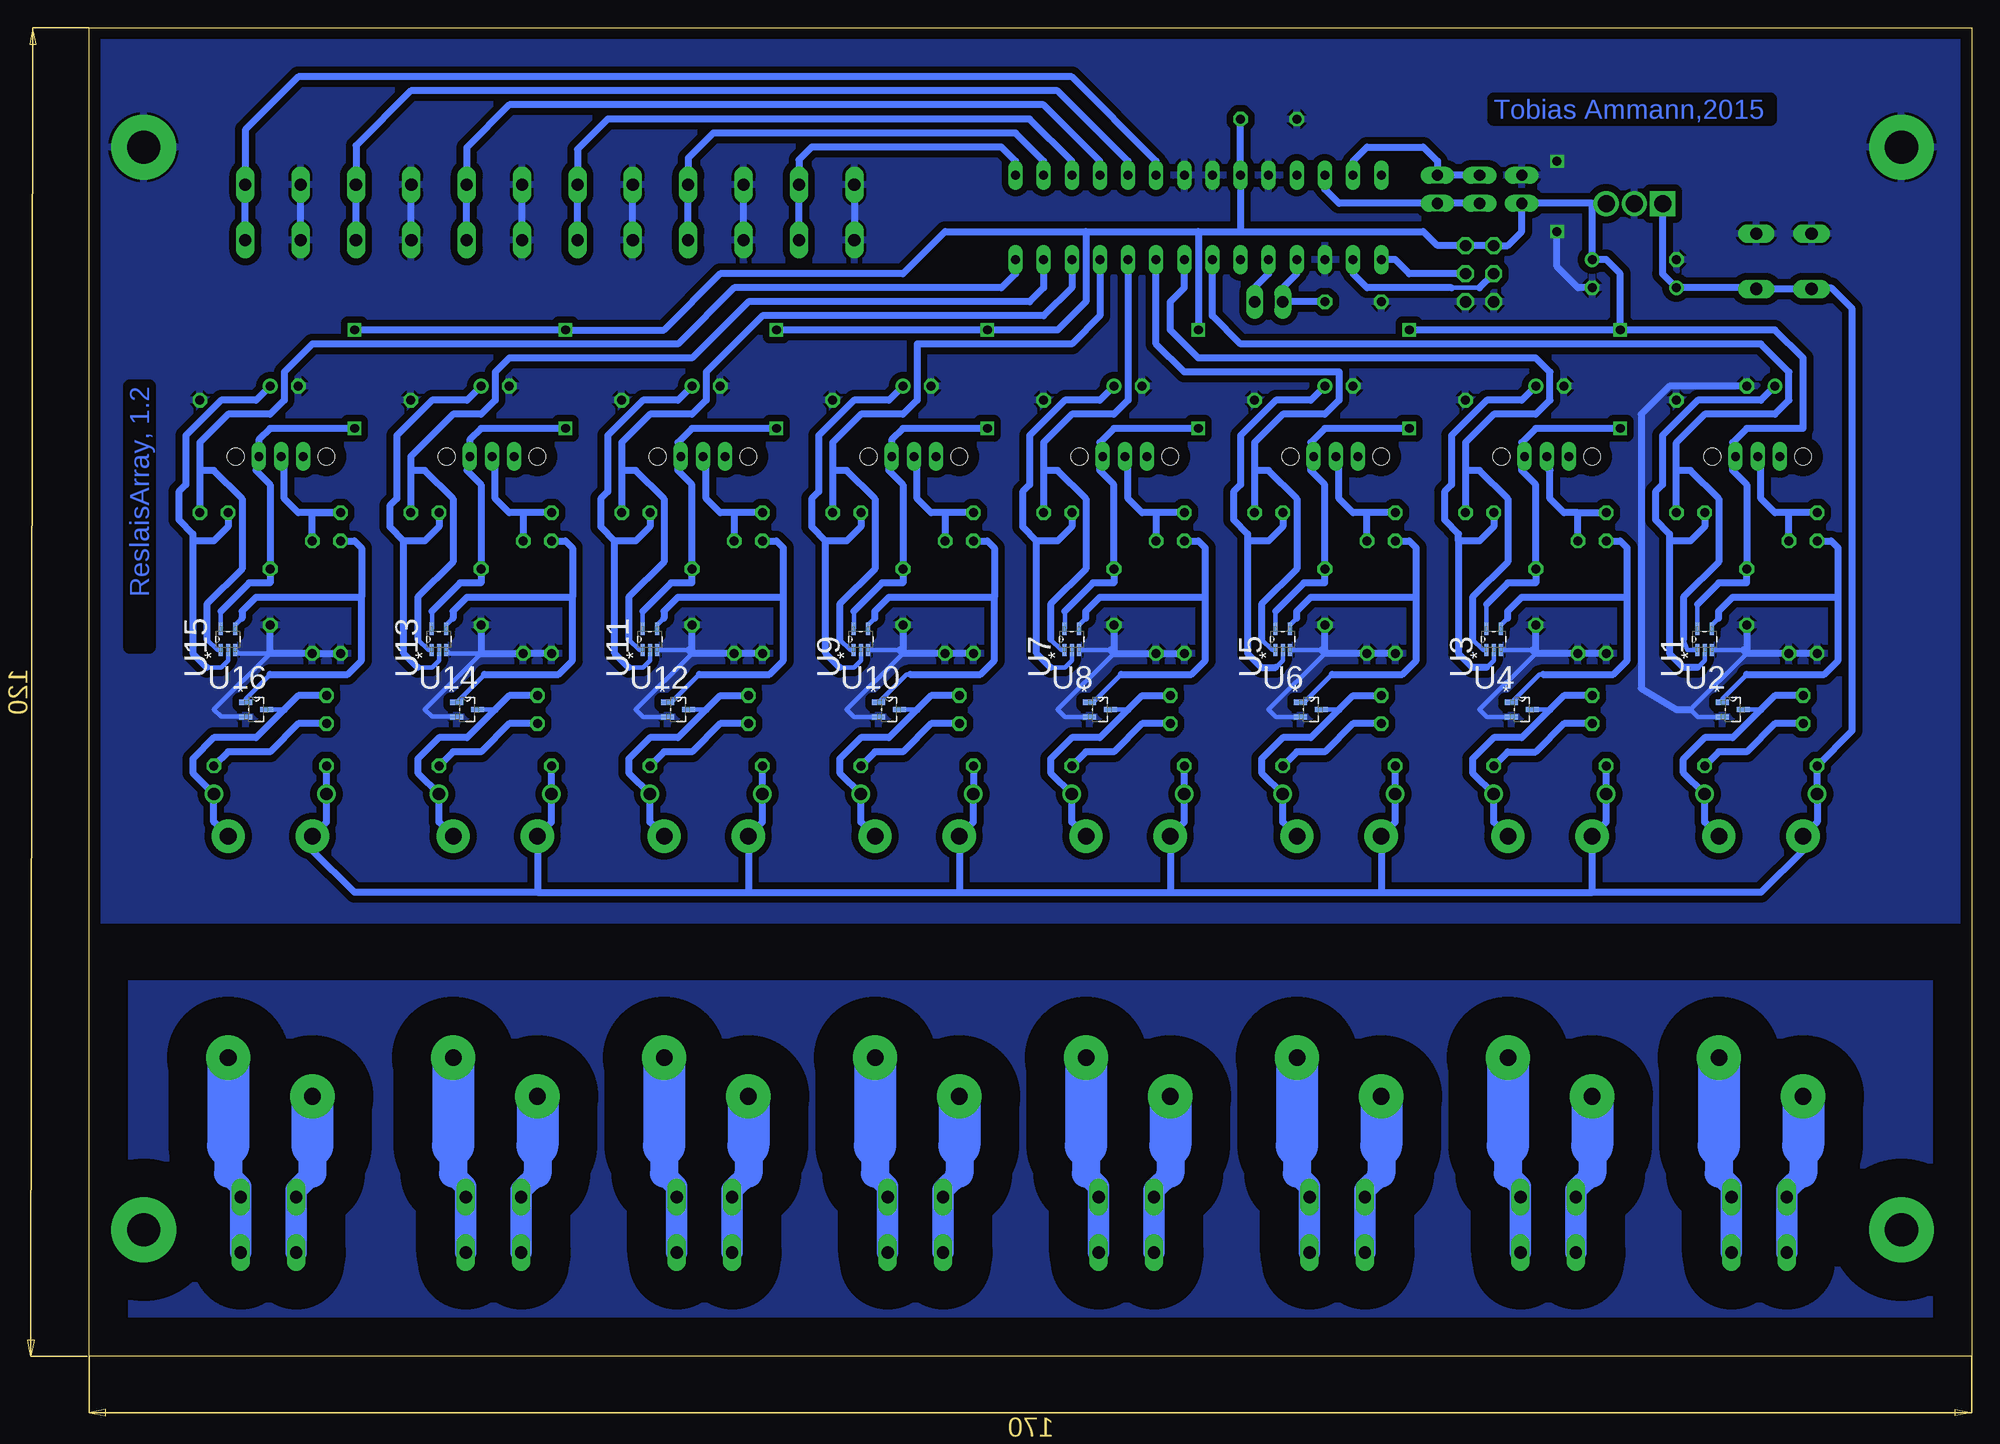
[diagram p6: board, bottom side, seen from below]

Size 170 x 120 mm. Coordinates in mm from the lower left corner, seen from the top.
Outline: 0,0 170,0 170,120 0,120 0,0
Copper layers (1*16): Top 0.035mm / dielectric 1.5mm / Bottom 0.035mm
Design rules "default": minimum track width 10mil, minimum drill 24mil, track to track 8mil, track to pad 8mil, pad to pad 8mil, via to via 8mil, smd to smd 8mil, copper to edge 40mil, drill to drill 8mil, minimum pad ring 10mil, minimum via ring 8mil, stop-mask expansion 4mil, vias tented up to drill 0mil, thermal gap 10mil

### Footprints (pad centres in the part's own frame; a part is rotated, then mirrored left to right if it is on the bottom)
TT2D5 = drill 0.813: + -1.27,0 | drill 0.813 octagon: - 1.27,0
C050-035X075 = drill 0.813 octagon: 1 -2.54,0; 2 2.54,0
DO41-10 = drill 1.118: A 5.08,0; C -5.08,0
3,0-PAD = drill 3 pad 5.842: B3,0 0,0
TO254P482X1024X3124-3P = drill 1.524 square: 1 -5.105,-1.295 | drill 1.524: 2 -2.54,-1.295; 3 0,-1.295
DIL28-3 = drill 0.813 long: 1 -16.51,-3.81; 2 -13.97,-3.81; 3 -11.43,-3.81; 4 -8.89,-3.81; 5 -6.35,-3.81; 6 -3.81,-3.81; 7 -1.27,-3.81; 8 1.27,-3.81; 9 3.81,-3.81; 10 6.35,-3.81; 11 8.89,-3.81; 12 11.43,-3.81; 13 13.97,-3.81; 14 16.51,-3.81; 15 16.51,3.81; 16 13.97,3.81; 17 11.43,3.81; 18 8.89,3.81; 19 6.35,3.81; 20 3.81,3.81; 21 1.27,3.81; 22 -1.27,3.81; 23 -3.81,3.81; 24 -6.35,3.81; 25 -8.89,3.81; 26 -11.43,3.81; 27 -13.97,3.81; 28 -16.51,3.81
1X02 = drill 1.016 long: 1 -1.27,0; 2 1.27,0
2X03 = drill 1.016 octagon: 1 -2.54,-1.27; 2 -2.54,1.27; 3 0,-1.27; 4 0,1.27; 5 2.54,-1.27; 6 2.54,1.27
TE_CON_OMIH = drill 1.5 pad 3: A1 0,0; A2 0,7.6 | drill 1.5 pad 4: P 20,7.6; S 23.5,0
LED5MM = drill 0.813 octagon: A -1.27,0; K 1.27,0
0207/10 = drill 0.813 octagon: 1 -5.08,0; 2 5.08,0
OS102011MS2QS1 = drill 0.8 long: 1 2.1,0; 2/C 4.1,0; 3 6.1,0 | hole 1.5: 0,0; 8.2,0
SOT65P210X110-5N = smd 1.118 x 0.356: 1 -0.965,0.66; 2 -0.965,0; 3 -0.965,-0.66; 4 0.965,-0.66; 5 0.965,0.66
SOT65P210X110-3N = smd 1.168 x 0.457: 1 -0.94,0.66; 2 -0.94,-0.66; 3 0.94,0
P-236-412 = drill 1.1 long: L1.1 2.957,27.35; L1.2 -2.043,27.35; L2.1 2.957,22.35; L2.2 -2.043,22.35; L3.1 2.957,17.35; L3.2 -2.043,17.35; L4.1 2.957,12.35; L4.2 -2.043,12.35; L5.1 2.957,7.35; L5.2 -2.043,7.35; L6.1 2.957,2.35; L6.2 -2.043,2.35; L7.1 2.957,-2.65; L7.2 -2.043,-2.65; L8.1 2.957,-7.65; L8.2 -2.043,-7.65; L9.1 2.957,-12.65; L9.2 -2.043,-12.65; L10.1 2.957,-17.65; L10.2 -2.043,-17.65; L11.1 2.957,-22.65; L11.2 -2.043,-22.65; L12.1 2.957,-27.65; L12.2 -2.043,-27.65
P-236-402 = drill 1.1 long: L1.1 2.957,2.35; L1.2 -2.043,2.35; L2.1 2.957,-2.65; L2.2 -2.043,-2.65

### Placement (x,y rotation side)
C1  26.67,97.79 90 top
C2  63.5,111.76 0 top
C3  34.29,97.79 270 top
C4  19.05,87.63 0 top
C5  20.32,68.58 90 top
C6  38.1,87.63 180 top
C7  39.37,68.58 90 top
C8  57.15,87.63 180 top
C9  58.42,68.58 90 top
C10  76.2,87.63 180 top
C11  77.47,68.58 90 top
C12  95.25,87.63 180 top
C13  96.52,68.58 90 top
C14  114.3,87.63 180 top
C15  115.57,68.58 90 top
C16  133.35,87.63 180 top
C17  134.62,68.58 90 top
C18  152.4,87.63 180 top
C19  153.67,68.58 90 top
C20  55.88,95.25 180 top
D1  19.05,50.8 0 top
D2  38.1,50.8 0 top
D3  57.15,50.8 0 top
D4  76.2,50.8 0 top
D5  95.25,50.8 0 top
D6  114.3,50.8 0 top
D7  133.35,50.8 0 top
D8  153.67,50.8 0 top
H1  6.35,109.22 0 top
H2  165.1,109.22 0 top
H3  6.35,11.43 0 top
H4  165.1,11.43 0 top
IC1  33.02,105.41 0 top
IC2  69.85,102.87 180 top
JP1  44.45,105.41 270 top
JP2  40.64,105.41 270 top
JP3  44.45,97.79 270 top
JP4  63.5,95.25 180 top
JP5  48.26,105.41 270 top
K1  15.24,46.99 270 top
K2  34.29,46.99 270 top
K3  53.34,46.99 270 top
K4  72.39,46.99 270 top
K5  91.44,46.99 270 top
K6  110.49,46.99 270 top
K7  129.54,46.99 270 top
K8  149.86,46.99 270 top
LED1  15.24,58.42 90 top
LED2  34.29,58.42 90 top
LED3  53.34,58.42 90 top
LED4  72.39,58.42 90 top
LED5  91.44,58.42 90 top
LED6  110.49,58.42 90 top
LED7  129.54,58.42 90 top
LED8  148.59,58.42 90 top
R1  16.51,68.58 90 top
R2  19.05,76.2 180 top
R3  13.97,68.58 90 top
R4  19.05,53.34 180 top
R5  35.56,68.58 90 top
R6  38.1,76.2 180 top
R7  33.02,68.58 90 top
R8  38.1,53.34 180 top
R9  54.61,68.58 90 top
R10  57.15,76.2 180 top
R11  52.07,68.58 90 top
R12  57.15,53.34 180 top
R13  73.66,68.58 90 top
R14  76.2,76.2 180 top
R15  71.12,68.58 90 top
R16  76.2,53.34 180 top
R17  92.71,68.58 90 top
R18  95.25,76.2 180 top
R19  90.17,68.58 90 top
R20  95.25,53.34 180 top
R21  111.76,68.58 90 top
R22  114.3,76.2 180 top
R23  109.22,68.58 90 top
R24  114.3,53.34 180 top
R25  130.81,68.58 90 top
R26  133.35,76.2 180 top
R27  128.27,68.58 90 top
R28  133.35,53.34 180 top
R29  149.86,68.58 90 top
R30  152.4,76.2 180 top
R31  147.32,68.58 90 top
R32  153.67,53.34 180 top
R33  45.72,81.28 90 top
R34  26.67,81.28 90 top
R35  64.77,81.28 90 top
R36  83.82,81.28 90 top
R37  102.87,81.28 90 top
R38  121.92,81.28 90 top
R39  140.97,81.28 90 top
R40  160.02,81.28 90 top
S1  15.24,81.28 0 top
S2  34.29,81.28 0 top
S3  53.34,81.28 0 top
S4  72.39,81.28 0 top
S5  91.44,81.28 0 top
S6  110.49,81.28 0 top
S7  129.54,81.28 0 top
S8  148.59,81.28 0 top
U1  24.13,64.77 90 bottom
U2  21.59,58.42 0 bottom
U3  43.18,64.77 90 bottom
U4  40.64,58.42 0 bottom
U5  62.23,64.77 90 bottom
U6  59.69,58.42 0 bottom
U7  81.28,64.77 90 bottom
U8  78.74,58.42 0 bottom
U9  100.33,64.77 90 bottom
U10  97.79,58.42 0 bottom
U11  119.38,64.77 90 bottom
U12  116.84,58.42 0 bottom
U13  138.43,64.77 90 bottom
U14  135.89,58.42 0 bottom
U15  157.48,64.77 90 bottom
U16  154.94,58.42 0 bottom
X1  128.27,102.87 90 top
X2  16.51,99.06 0 top
X3  19.05,11.43 90 top
X4  38.1,11.43 90 top
X5  57.15,11.43 90 top
X6  76.2,11.43 90 top
X7  95.25,11.43 90 top
X8  114.3,11.43 90 top
X9  133.35,11.43 90 top
X10  153.67,11.43 90 top

### Tracks (layer width: path | path; a pad name or v marks a point on that pad's centre or on a via)
+5V  (via drill 0.8)
  Top 0.61: v50.8,92.71 v50.8,83.82 | v31.75,83.82 v31.75,92.71 | v69.85,92.71 v69.85,83.82 | v88.9,92.71 v88.9,83.82 | v107.95,92.71 v107.95,83.82 | v127,92.71 v127,83.82 | v146.05,92.71 v146.05,83.82
  Bottom 0.406: U5.5 62.89,67.28 62.87,67.31 | 81.92,67.31 81.92,65.76 U7.5 | 100.97,67.31 100.97,65.76 U9.5 | U11.5 120.04,67.28 120.02,67.31 | U13.5 139.06,65.76 139.06,67.31 | 158.12,67.31 158.14,67.28 U15.5 | U1.5 24.79,67.92 24.77,67.94 | U3.5 43.84,67.92 43.81,67.94
  Bottom 0.61: v31.75,83.82 39.37,83.82 40.64,82.55 40.64,81.53 S2.3 40.64,81.03 40.64,80.01 39.37,78.74 C7.2 39.37,69.85 41.91,69.85 43.81,67.94 | v31.75,92.71 v50.8,92.71 | v50.8,83.82 58.42,83.82 59.69,82.55 59.69,81.53 S3.3 59.69,81.03 59.69,80.01 58.42,78.74 C9.2 58.42,69.85 60.33,69.85 62.87,67.31 | v69.85,83.82 77.47,83.82 78.74,82.55 78.74,81.28 | 78.74,81.28 78.74,80.01 77.47,78.74 C11.2 77.47,69.85 79.38,69.85 81.92,67.31 | 78.74,81.28 S4.3 | C2.2 IC2.9 66.04,101.6 | 66.04,101.6 49.53,101.6 48.26,100.33 JP3.2 JP3.1 41.91,100.33 40.64,101.6 JP2.2 34.29,104.14 | v88.9,83.82 96.52,83.82 97.54,82.8 S5.3 97.79,81.03 97.79,80.01 96.52,78.74 C13.2 96.52,69.85 98.42,69.85 100.97,67.31 | 69.85,101.6 v69.85,92.71 | v107.95,92.71 v88.9,92.71 82.55,92.71 80.01,95.25 80.01,101.6 | v107.95,83.82 115.57,83.82 116.84,82.55 116.84,81.28 S6.3 116.84,81.03 116.84,80.01 115.57,78.74 C15.2 115.57,69.85 117.47,69.85 120.02,67.31 | v127,83.82 134.62,83.82 135.64,82.8 S7.3 135.89,81.03 135.89,80.01 134.62,78.74 C17.2 134.62,69.85 136.53,69.85 139.06,67.31 | v146.05,83.82 153.67,83.82 154.69,82.8 S8.3 154.94,81.03 154.94,80.01 153.67,78.74 C19.2 153.67,69.85 155.57,69.85 158.12,67.31 | 69.85,101.6 66.04,101.6 | 80.01,101.6 92.71,101.6 96.52,97.79 113.03,97.79 118.11,92.71 v127,92.71 v146.05,92.71 | 80.01,101.6 69.85,101.6 | v31.75,92.71 31.75,97.79 33.02,99.06 C3.+ 34.29,104.14 | 34.29,104.14 34.27,104.11 IC1.3 | 21.59,81.28 21.59,80.01 20.32,78.74 C5.2 20.32,69.85 22.86,69.85 24.77,67.94 | 21.59,81.28 21.59,82.55 20.32,83.82 15.24,83.82 15.24,90.17 17.78,92.71 v31.75,92.71
  Bottom 0.61: 21.59,81.28 S1.3
+12V
  Bottom 0.61: R8.2 D2.C 33.02,48.26 K2.A1 34.29,41.91 | X2.L2.2 15.24,96.41 | 15.24,96.41 X2.L2.1 19.58,96.52 C1.+ 27.94,97.79 27.91,97.81 IC1.1 27.94,104.09 | 53.34,41.91 K3.A1 52.07,48.26 D3.C R12.2 | 53.34,41.91 34.29,41.91 | 15.24,96.41 15.24,96.52 12.7,96.52 10.79,94.61 10.79,56.52 R4.2 D1.C 13.97,48.26 K1.A1 15.24,45.72 19.05,41.91 34.29,41.91 | R16.2 D4.C 71.12,48.26 K4.A1 72.39,41.91 | R20.2 D5.C 90.17,48.26 K5.A1 91.44,41.91 | 72.39,41.91 53.34,41.91 | 91.44,41.91 72.39,41.91 | R24.2 D6.C 109.22,48.26 K6.A1 110.49,41.91 | 110.49,41.91 91.44,41.91 | 129.54,41.91 K7.A1 128.27,48.26 D7.C R28.2 | 129.54,41.91 110.49,41.91 | R32.2 D8.C 148.59,48.26 K8.A1 149.86,45.72 146.05,41.91 129.54,41.91
GND  (via drill 0.8)
  Top 0.61: v37.47,101.6 v37.47,107.95
  Bottom 0.406: U2.2 24.74,57.76 25.4,58.42 20.32,63.5 | U4.2 43.79,57.76 44.45,58.42 39.37,63.5 | 58.42,63.5 63.5,58.42 62.84,57.76 U6.2 | 77.47,63.5 82.55,58.42 81.89,57.76 U8.2 | U10.2 100.94,57.76 101.6,58.42 96.52,63.5 | U12.2 119.99,57.76 120.65,58.42 115.57,63.5 | 20.62,63.8 U1.3 | 39.67,63.8 U3.3 | 58.73,63.8 U5.3 | 77.78,63.8 U7.3 | 96.83,63.8 U9.3 | 115.88,63.8 U11.3 | U14.2 136.85,57.78 139.06,57.78 139.7,58.42 134.62,63.5 137.47,63.5 U13.3 | 153.03,63.5 152.4,63.5 | U15.3 156.51,63.5 153.67,63.5 158.75,58.42 158.12,57.78 155.91,57.78 U16.2
  Bottom 0.61: 25.4,58.42 26.67,58.42 29.84,60.33 29.84,85.09 27.3,87.63 C4.- | R3.1 R1.1 20.32,63.5 | C5.1 20.32,63.5 | R7.1 R5.1 39.37,63.5 | 39.37,63.5 C7.1 | 39.67,63.8 39.37,63.5 | 20.62,63.8 20.32,63.5 | R11.1 R9.1 58.42,63.5 | 58.42,63.5 C9.1 | 58.73,63.8 58.42,63.5 | C11.1 77.47,63.5 | 77.47,63.5 R13.1 R15.1 | 77.78,63.8 77.47,63.5 | R19.1 R17.1 96.52,63.5 | C13.1 96.52,63.5 | 96.83,63.8 96.52,63.5 | R23.1 R21.1 115.57,63.5 | 115.57,63.5 C15.1 | 115.88,63.8 115.57,63.5 | R27.1 R25.1 134.62,63.5 C17.1 | C19.1 153.67,63.5 152.4,63.5 R29.1 R31.1 | C3.- 35.56,96.52 37.47,98.42 v37.47,101.6 | X1.L1.1 X1.L1.2 | X1.L3.2 X1.L3.1 | X1.L5.2 X1.L5.1 | X1.L7.2 X1.L7.1 | X1.L9.2 X1.L9.1 | X1.L11.2 X1.L11.1
  pour Bottom (isolate 0.61): -1.27,120.65 -1.27,39.37 170.18,39.37 170.18,120.65
GPA0
  Bottom 0.406: U1.1 25.7,63.8 26.04,64.77
  Bottom 0.61: 26.04,64.77 26.04,68.58 22.86,71.75 22.86,77.47 25.4,80.01 26.67,80.01 | IC2.21 68.58,93.98 66.04,91.44 19.05,91.44 16.51,88.9 16.51,86.36 17.78,85.09 24.13,85.09 26.67,82.55 26.67,80.01 | R34.1 26.67,80.01
GPA1
  Bottom 0.406: U3.1 44.12,63.8 45.09,64.77
  Bottom 0.61: 45.09,64.77 45.09,68.58 41.91,71.75 41.91,77.47 44.45,80.01 45.72,80.01 | IC2.22 71.12,96.52 72.39,95.25 72.39,92.71 69.85,90.17 39.37,90.17 38.1,88.9 38.1,86.36 39.37,85.09 43.18,85.09 45.72,82.55 45.72,80.01 | 45.72,80.01 R33.1
GPA2
  Bottom 0.406: U5.1 63.17,63.8 64.14,64.77
  Bottom 0.61: 64.14,64.77 64.14,67.94 60.96,71.12 60.96,77.47 63.5,80.01 64.77,80.01 | IC2.23 73.66,91.44 71.12,88.9 57.15,88.9 57.15,86.36 58.42,85.09 62.23,85.09 64.77,82.55 64.77,80.01 | 64.77,80.01 R35.1
GPA3
  Bottom 0.406: 83.19,64.77 82.22,63.8 U7.1
  Bottom 0.61: IC2.24 76.2,86.36 77.47,85.09 81.28,85.09 83.82,82.55 83.82,80.01 | 83.19,64.77 83.19,67.94 80.01,71.12 80.01,77.47 82.55,80.01 83.82,80.01 | 83.82,80.01 R36.1
GPA4
  Bottom 0.406: U9.1 101.27,63.8 102.23,64.77
  Bottom 0.61: IC2.25 78.74,93.98 81.28,91.44 95.25,91.44 95.25,86.36 96.52,85.09 100.33,85.09 102.87,82.55 102.87,80.01 | 102.23,64.77 102.23,67.94 99.06,71.12 99.06,77.47 101.6,80.01 102.87,80.01 | 102.87,80.01 R37.1
GPA5
  Bottom 0.406: U11.1 120.32,63.8 121.28,64.77
  Bottom 0.61: IC2.26 81.28,96.52 83.82,93.98 109.22,93.98 114.3,88.9 114.3,86.36 115.57,85.09 119.38,85.09 121.92,82.55 121.92,80.01 | 121.28,64.77 121.28,68.58 118.11,71.75 118.11,77.47 120.65,80.01 121.92,80.01 | 121.92,80.01 R38.1
GPA6
  Bottom 0.406: 140.34,64.77 139.37,63.8 U13.1
  Bottom 0.61: IC2.27 83.82,96.52 85.09,95.25 110.49,95.25 115.57,90.17 132.08,90.17 133.35,88.9 133.35,86.36 134.62,85.09 137.16,85.09 140.97,81.28 140.97,80.01 | 140.34,64.77 140.34,68.58 137.16,71.75 137.16,77.47 139.7,80.01 140.97,80.01 | 140.97,80.01 R39.1
GPA7
  Bottom 0.406: 159.38,64.77 158.42,63.8 U15.1
  Bottom 0.61: IC2.28 86.36,97.79 87.63,96.52 111.76,96.52 116.84,91.44 149.86,91.44 152.4,88.9 152.4,86.36 153.67,85.09 157.48,85.09 160.02,82.55 160.02,80.01 | 159.38,64.77 159.38,67.94 156.21,71.12 156.21,77.47 158.75,80.01 160.02,80.01 | 160.02,80.01 R40.1
INTB
  Bottom 0.61: JP4.1 64.77,96.52 63.5,97.79 IC2.19
N$1
  Bottom 0.406: U6.1 60.3,59.08 57.78,61.59 | U5.4 61.57,66.06 60.96,66.67
  Bottom 0.61: 50.16,68.58 50.16,73.03 50.8,73.66 R11.2 | 60.96,66.67 60.96,67.31 59.69,68.58 50.16,68.58 | 57.78,61.59 51.44,61.59 50.16,62.87 50.16,68.58
N$2
  Bottom 0.61: LED3.A 55.88,57.15 58.42,54.61 60.96,54.61 R12.1
N$3
  Bottom 0.406: U6.3 57.15,58.42
  Bottom 0.61: K3.A2 60.96,46.99 62.23,48.26 D3.A 64.14,52.7 64.14,53.98 62.23,55.88 59.69,55.88 57.15,58.42 55.88,59.69 LED3.K
N$4
  Bottom 0.61: R10.2 54.61,76.2 | R9.2 54.61,76.2 | 54.61,76.2 55.88,76.2 57.15,77.47 57.15,80.99 S3.2/C
N$5
  Bottom 1.93: X5.L2.2 X5.L2.1 59.8,15.35 60.96,16.51
  Bottom 2.54: 60.96,19.05 60.96,16.51
  Bottom 3.81: K3.P 60.94,19.07 60.96,19.05
N$6
  Bottom 1.93: X5.L1.2 X5.L1.1 54.8,15.05 53.34,16.51
  Bottom 2.54: 53.34,19.05 53.34,16.51
  Bottom 3.81: K3.S 53.34,19.05
N$7
  Bottom 0.406: U5.2 62.23,62.87 62.87,62.23
  Bottom 0.61: 62.87,62.23 64.14,62.23 65.41,63.5 65.41,73.66 | C8.+ 59.69,86.36 62.87,86.36 66.04,83.19 66.04,78.74 66.67,78.11 66.67,75.56 65.41,74.3 65.41,73.66 | R10.1 62.23,74.93 63.5,73.66 65.41,73.66
N$8
  Bottom 0.406: 44.45,96.52 46.99,96.52
  Bottom 0.61: 44.45,96.52 JP3.3 | IC2.16 55.88,97.79 54.61,96.52 46.99,96.52
N$12
  Bottom 0.61: JP3.4 50.8,97.79 52.07,99.06 IC2.15
N$13
  pour Bottom (isolate 3.5): -1.27,33.66 170.18,33.66 170.18,-1.27 -1.27,-1.27
N$14
  Bottom 0.61: IC2.6 73.66,107.95 81.28,115.57 151.13,115.57 155.92,110.78 X1.L12.1 X1.L12.2
N$15
  Bottom 0.61: IC2.5 76.2,107.95 82.55,114.3 140.97,114.3 145.92,109.35 X1.L10.1 X1.L10.2
N$16
  Bottom 0.61: IC2.4 78.74,107.95 83.82,113.03 132.08,113.03 135.92,109.19 X1.L8.1 X1.L8.2
N$17
  Bottom 0.61: IC2.3 81.28,107.95 85.09,111.76 123.19,111.76 125.92,109.03 X1.L6.1 X1.L6.2
N$18
  Bottom 0.61: IC2.2 83.82,107.95 86.36,110.49 113.67,110.49 115.92,108.23 X1.L4.1 X1.L4.2
N$19
  Bottom 0.61: IC2.1 86.36,107.95 87.63,109.22 104.78,109.22 105.92,108.08 X1.L2.1 X1.L2.2
N$20
  Bottom 0.406: U8.1 79.35,59.08 76.83,61.59 | U7.4 80.62,66.06 80.01,66.67
  Bottom 0.61: 69.22,68.58 69.22,73.03 69.85,73.66 R15.2 | 80.01,66.67 80.01,67.31 78.74,68.58 69.22,68.58 | 76.83,61.59 70.48,61.59 69.22,62.87 69.22,68.58
N$21
  Bottom 0.61: LED4.A 74.93,57.15 77.47,54.61 80.01,54.61 R16.1
N$22
  Bottom 0.406: U8.3 76.2,58.42
  Bottom 0.61: K4.A2 80.01,46.99 81.28,48.26 D4.A 83.19,52.7 83.19,53.98 81.28,55.88 78.74,55.88 76.2,58.42 74.93,59.69 LED4.K
N$23
  Bottom 0.61: R14.2 73.66,76.2 | 73.66,76.2 R13.2 | 73.66,76.2 74.93,76.2 76.2,77.47 76.2,80.99 S4.2/C
N$24
  Bottom 1.93: X6.L2.2 X6.L2.1 78.85,15.35 80.01,16.51
  Bottom 2.54: 80.01,19.05 80.01,16.51
  Bottom 3.81: K4.P 79.99,19.07 80.01,19.05
N$25
  Bottom 1.93: X6.L1.2 X6.L1.1 73.85,15.05 72.39,16.51
  Bottom 2.54: 72.39,19.05 72.39,16.51
  Bottom 3.81: K4.S 72.39,19.05
N$26
  Bottom 0.406: U7.2 81.28,62.87 81.92,62.23 83.19,62.23
  Bottom 0.61: 83.19,62.23 84.45,63.5 84.45,73.66 | C10.+ 78.74,86.36 81.92,86.36 85.09,83.19 85.09,78.74 85.72,78.11 85.72,74.93 84.45,73.66 | R14.1 81.28,74.93 82.55,73.66 84.45,73.66
N$27
  Bottom 0.406: U9.4 99.67,66.06 99.06,66.67 | 95.89,61.59 96.22,61.59 U10.1
  Bottom 0.61: 88.27,68.58 88.27,73.03 88.9,73.66 R19.2 | 99.06,66.67 99.06,67.31 97.79,68.58 88.27,68.58 | 95.89,61.59 89.53,61.59 88.27,62.87 88.27,68.58
N$28
  Bottom 0.61: LED5.A 93.98,57.15 96.52,54.61 99.06,54.61 R20.1
N$29
  Bottom 0.406: U10.3 95.25,58.42
  Bottom 0.61: K5.A2 99.06,46.99 100.33,48.26 D5.A 102.23,52.7 102.23,53.98 100.33,55.88 97.79,55.88 95.25,58.42 93.98,59.69 LED5.K
N$30
  Bottom 0.61: R18.2 92.71,76.2 | 92.71,76.2 R17.2 | 92.71,76.2 93.98,76.2 95.25,77.47 95.25,80.99 S5.2/C
N$31
  Bottom 1.93: X7.L2.2 X7.L2.1 97.9,15.35 99.06,16.51
  Bottom 2.54: 99.06,19.05 99.06,16.51
  Bottom 3.81: K5.P 99.04,19.07 99.06,19.05
N$32
  Bottom 1.93: X7.L1.2 X7.L1.1 92.9,15.05 91.44,16.51
  Bottom 2.54: 91.44,19.05 91.44,16.51
  Bottom 3.81: K5.S 91.44,19.05
N$33
  Bottom 0.406: U9.2 100.33,62.87 100.97,62.23 102.23,62.23
  Bottom 0.61: 102.23,62.23 103.5,63.5 103.5,73.66 | C12.+ 97.79,86.36 100.97,86.36 104.14,83.19 104.14,78.11 104.78,77.47 104.78,74.93 103.5,73.66 | R18.1 100.33,74.93 101.6,73.66 103.5,73.66
N$34
  Bottom 0.406: U12.1 117.45,59.08 114.94,61.59 | U11.4 118.72,66.06 118.11,66.67
  Bottom 0.61: 107.31,68.58 107.31,73.03 107.95,73.66 R23.2 | 107.31,68.58 116.84,68.58 118.11,67.31 118.11,66.67 | 114.94,61.59 108.58,61.59 107.31,62.87 107.31,68.58
N$35
  Bottom 0.61: LED6.A 113.03,57.15 115.57,54.61 118.11,54.61 R24.1
N$36
  Bottom 0.406: U12.3 114.3,58.42
  Bottom 0.61: K6.A2 118.11,46.99 119.38,48.26 D6.A 121.28,52.7 121.28,53.98 119.38,55.88 116.84,55.88 114.3,58.42 113.03,59.69 LED6.K
N$37
  Bottom 0.61: R21.2 111.76,76.2 R22.2 113.03,76.2 114.3,77.47 114.3,80.99 S6.2/C
N$38
  Bottom 1.93: X8.L2.2 X8.L2.1 116.95,15.35 118.11,16.51
  Bottom 2.54: 118.11,19.05 118.11,16.51
  Bottom 3.81: K6.P 118.09,19.07 118.11,19.05
N$39
  Bottom 1.93: X8.L1.2 X8.L1.1 111.95,15.05 110.49,16.51
  Bottom 2.54: 110.49,19.05 110.49,16.51
  Bottom 3.81: K6.S 110.49,19.05
N$40
  Bottom 0.406: U11.2 119.38,62.87 120.02,62.23 121.28,62.23
  Bottom 0.61: 121.28,62.23 122.56,63.5 122.56,73.66 | C14.+ 116.84,86.36 120.02,86.36 123.19,83.19 123.19,78.11 123.83,77.47 123.83,74.93 122.56,73.66 | R22.1 119.38,74.93 120.65,73.66 122.56,73.66
N$41
  Bottom 0.406: U14.1 134.31,61.59 | U13.4 137.77,66.06 137.16,66.67
  Bottom 0.61: 126.36,68.58 126.36,73.03 127,73.66 R27.2 | 126.36,68.58 135.89,68.58 137.16,67.31 137.16,66.67 | 134.31,61.59 127.64,61.59 126.36,62.87 126.36,68.58
N$42
  Bottom 0.61: LED7.A 132.08,57.15 134.62,54.61 137.16,54.61 R28.1
N$43
  Bottom 0.406: U14.3 133.35,58.42
  Bottom 0.61: K7.A2 138.41,48.26 138.43,48.26 D7.A 140.34,52.7 140.34,53.98 138.43,55.88 135.89,55.88 133.35,58.42 132.08,59.69 LED7.K
N$44
  Bottom 0.61: R26.2 130.81,76.2 | 130.81,76.2 R25.2 | 130.81,76.2 132.08,76.2 133.35,77.47 133.35,80.99 S7.2/C
N$45
  Bottom 1.93: X9.L2.2 X9.L2.1 136,15.35 137.16,16.51
  Bottom 2.54: 137.16,19.05 137.16,16.51
  Bottom 3.81: K7.P 137.14,19.07 137.16,19.05
N$46
  Bottom 1.93: X9.L1.2 X9.L1.1 131,15.05 129.54,16.51
  Bottom 2.54: 129.54,19.05 129.54,16.51
  Bottom 3.81: K7.S 129.54,19.05
N$47
  Bottom 0.406: U13.2 138.43,62.87 139.06,62.23 140.34,62.23
  Bottom 0.61: 140.34,62.23 141.6,63.5 141.6,73.66 | C16.+ 135.89,86.36 139.06,86.36 142.24,83.19 142.24,77.47 142.88,76.83 142.88,74.93 141.6,73.66 | R26.1 138.43,74.93 139.7,73.66 141.6,73.66
N$48
  Bottom 0.406: 153.67,61.59 155.88,59.38 U16.1 | U15.4 156.82,66.06 156.21,66.67
  Bottom 0.61: 145.41,68.58 145.41,73.03 146.05,73.66 R31.2 | 145.41,68.58 154.94,68.58 156.21,67.31 156.21,66.67 | 153.67,61.59 146.69,61.59 145.41,62.87 145.41,68.58
N$49
  Bottom 0.61: LED8.A 151.13,57.15 153.67,54.61 157.48,54.61 R32.1
N$50
  Bottom 0.406: U16.3 152.4,58.42
  Bottom 0.61: K8.A2 158.73,48.26 158.75,48.26 D8.A 160.66,52.7 160.66,53.98 158.75,55.88 154.94,55.88 152.4,58.42 151.13,59.69 LED8.K
N$51
  Bottom 0.61: R29.2 149.86,76.2 R30.2 151.13,76.2 152.4,77.47 152.4,80.99 S8.2/C
N$52
  Bottom 1.93: X10.L2.2 X10.L2.1 156.32,15.35 157.48,16.51
  Bottom 2.54: 157.48,19.05 157.48,16.51
  Bottom 3.81: K8.P 157.46,19.07 157.48,19.05
N$53
  Bottom 1.93: X10.L1.2 X10.L1.1 151.32,15.05 149.86,16.51
  Bottom 2.54: 149.86,19.05 149.86,16.51
  Bottom 3.81: K8.S 149.86,19.05
N$54
  Bottom 0.406: U15.2 157.48,62.87 158.12,62.23 159.38,62.23
  Bottom 0.61: 159.38,62.23 160.66,63.5 160.66,73.66 | C18.+ 154.94,86.36 158.12,86.36 161.29,83.19 161.29,78.74 161.93,78.11 161.93,75.56 160.66,74.3 160.66,73.66 | R30.1 157.48,74.93 158.75,73.66 160.66,73.66
N$55
  Bottom 0.406: U1.4 23.47,66.04 22.86,66.67 | U2.1 22.53,59.38 20.32,61.59
  Bottom 0.61: 12.06,68.58 12.06,73.03 12.7,73.66 R3.2 | 22.86,66.67 22.86,67.31 21.59,68.58 12.06,68.58 | 20.32,61.59 13.34,61.59 12.06,62.87 12.06,68.58
N$56
  Bottom 0.61: LED1.A 17.78,57.15 20.32,54.61 22.86,54.61 R4.1
N$57
  Bottom 0.406: U2.3 19.05,58.42
  Bottom 0.61: 22.86,46.99 24.13,48.26 D1.A 26.04,52.7 26.04,53.98 24.13,55.88 21.59,55.88 19.05,58.42 17.78,59.69 LED1.K
  Bottom 0.813: K1.A2 22.86,46.99
N$58
  Bottom 0.61: R2.2 16.51,76.2 | R1.2 16.51,76.2 | 16.51,76.2 17.78,76.2 19.05,77.47 19.05,80.99 S1.2/C
N$59
  Bottom 1.93: X3.L2.2 X3.L2.1 21.7,15.35 22.86,16.51
  Bottom 2.54: 22.86,19.05 22.86,16.51
  Bottom 3.81: K1.P 22.84,19.07 22.86,19.05
N$60
  Bottom 1.93: X3.L1.2 X3.L1.1 16.7,15.05 15.24,16.51
  Bottom 2.54: 15.24,19.05 15.24,16.51
  Bottom 3.81: K1.S 15.24,19.05
N$61
  Bottom 0.406: U1.2 24.13,62.87 24.77,62.23
  Bottom 0.61: 24.77,62.23 26.04,62.23 27.3,63.5 27.3,73.66 | 27.3,73.66 27.3,74.3 28.57,75.56 28.57,78.11 27.94,78.74 27.94,83.19 24.77,86.36 19.05,86.36 C4.+ | R2.1 24.13,74.93 25.4,73.66 27.3,73.66
N$62
  Bottom 0.406: 41.91,66.67 42.52,66.04 U3.4 | U4.1 39.06,61.59 38.73,61.59
  Bottom 0.61: 31.11,68.58 31.11,73.03 31.75,73.66 R7.2 | 41.91,66.67 41.91,67.31 40.64,68.58 31.11,68.58 | 38.73,61.59 32.38,61.59 31.11,62.87 31.11,68.58
N$63
  Bottom 0.61: R8.1 41.91,54.61 39.37,54.61 36.83,57.15 LED2.A
N$64
  Bottom 0.406: U4.3 38.1,58.42
  Bottom 0.61: K2.A2 41.91,46.99 43.18,48.26 D2.A 45.09,52.7 45.09,53.98 43.18,55.88 40.64,55.88 38.1,58.42 36.83,59.69 LED2.K
N$65
  Bottom 0.61: 38.1,80.01 38.39,80.3 S2.2/C 38.1,80.99 38.1,77.47 36.83,76.2 35.56,76.2 | 35.56,76.2 R6.2 | R5.2 35.56,76.2
N$66
  Bottom 1.93: X4.L2.2 X4.L2.1 40.75,15.35 41.91,16.51
  Bottom 2.54: 41.91,19.05 41.91,16.51
  Bottom 3.81: K2.P 41.89,19.07 41.91,19.05
N$67
  Bottom 1.93: X4.L1.2 X4.L1.1 35.75,15.05 34.29,16.51
  Bottom 2.54: 34.29,19.05 34.29,16.51
  Bottom 3.81: K2.S 34.29,19.05
N$68
  Bottom 0.406: U3.2 43.18,62.87 43.81,62.23
  Bottom 0.61: 46.35,73.66 46.35,63.5 45.09,62.23 43.81,62.23 | C6.+ 40.64,86.36 43.81,86.36 46.99,83.19 46.99,78.74 47.62,78.11 47.62,75.56 46.35,74.3 46.35,73.66 | R6.1 43.18,74.93 44.45,73.66 46.35,73.66
RESET
  Bottom 0.61: IC2.18 60.96,97.79 62.23,96.52 JP4.2 C20.1
SCL
  Bottom 0.61: IC2.12 58.42,105.41 57.15,104.14 JP5.2 JP1.2
SDA
  Bottom 0.61: IC2.13 55.88,107.95 54.61,109.22 49.53,109.22 48.26,107.95 JP5.1 JP1.1

### Text on the board
Bottom: Tobias Ammann,2015 | ReslaisArray, 1.2